# EAGLE schematic headstage-256 (EAGLE 8.3.2)
DESIGNER: JON NEWMAN; DESIGN_NAME: headstage-128-256; LICENSE: CERN OHL v1.2; REVISION: 1.1
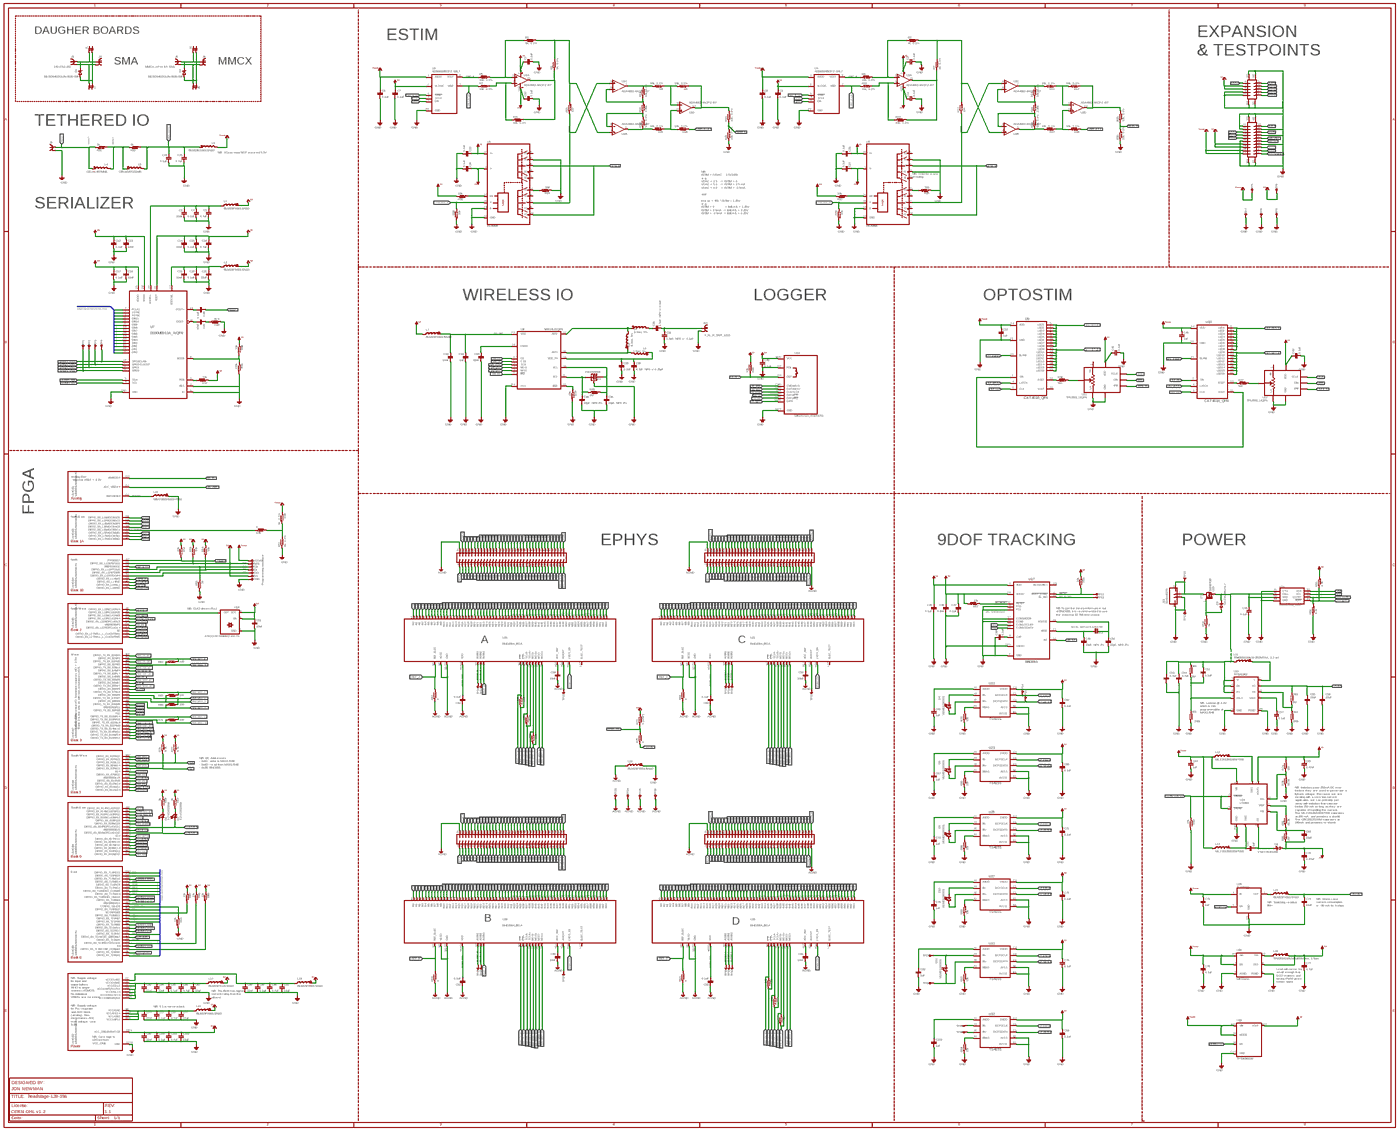
[diagram p0: schematic, sheet 1, overview]
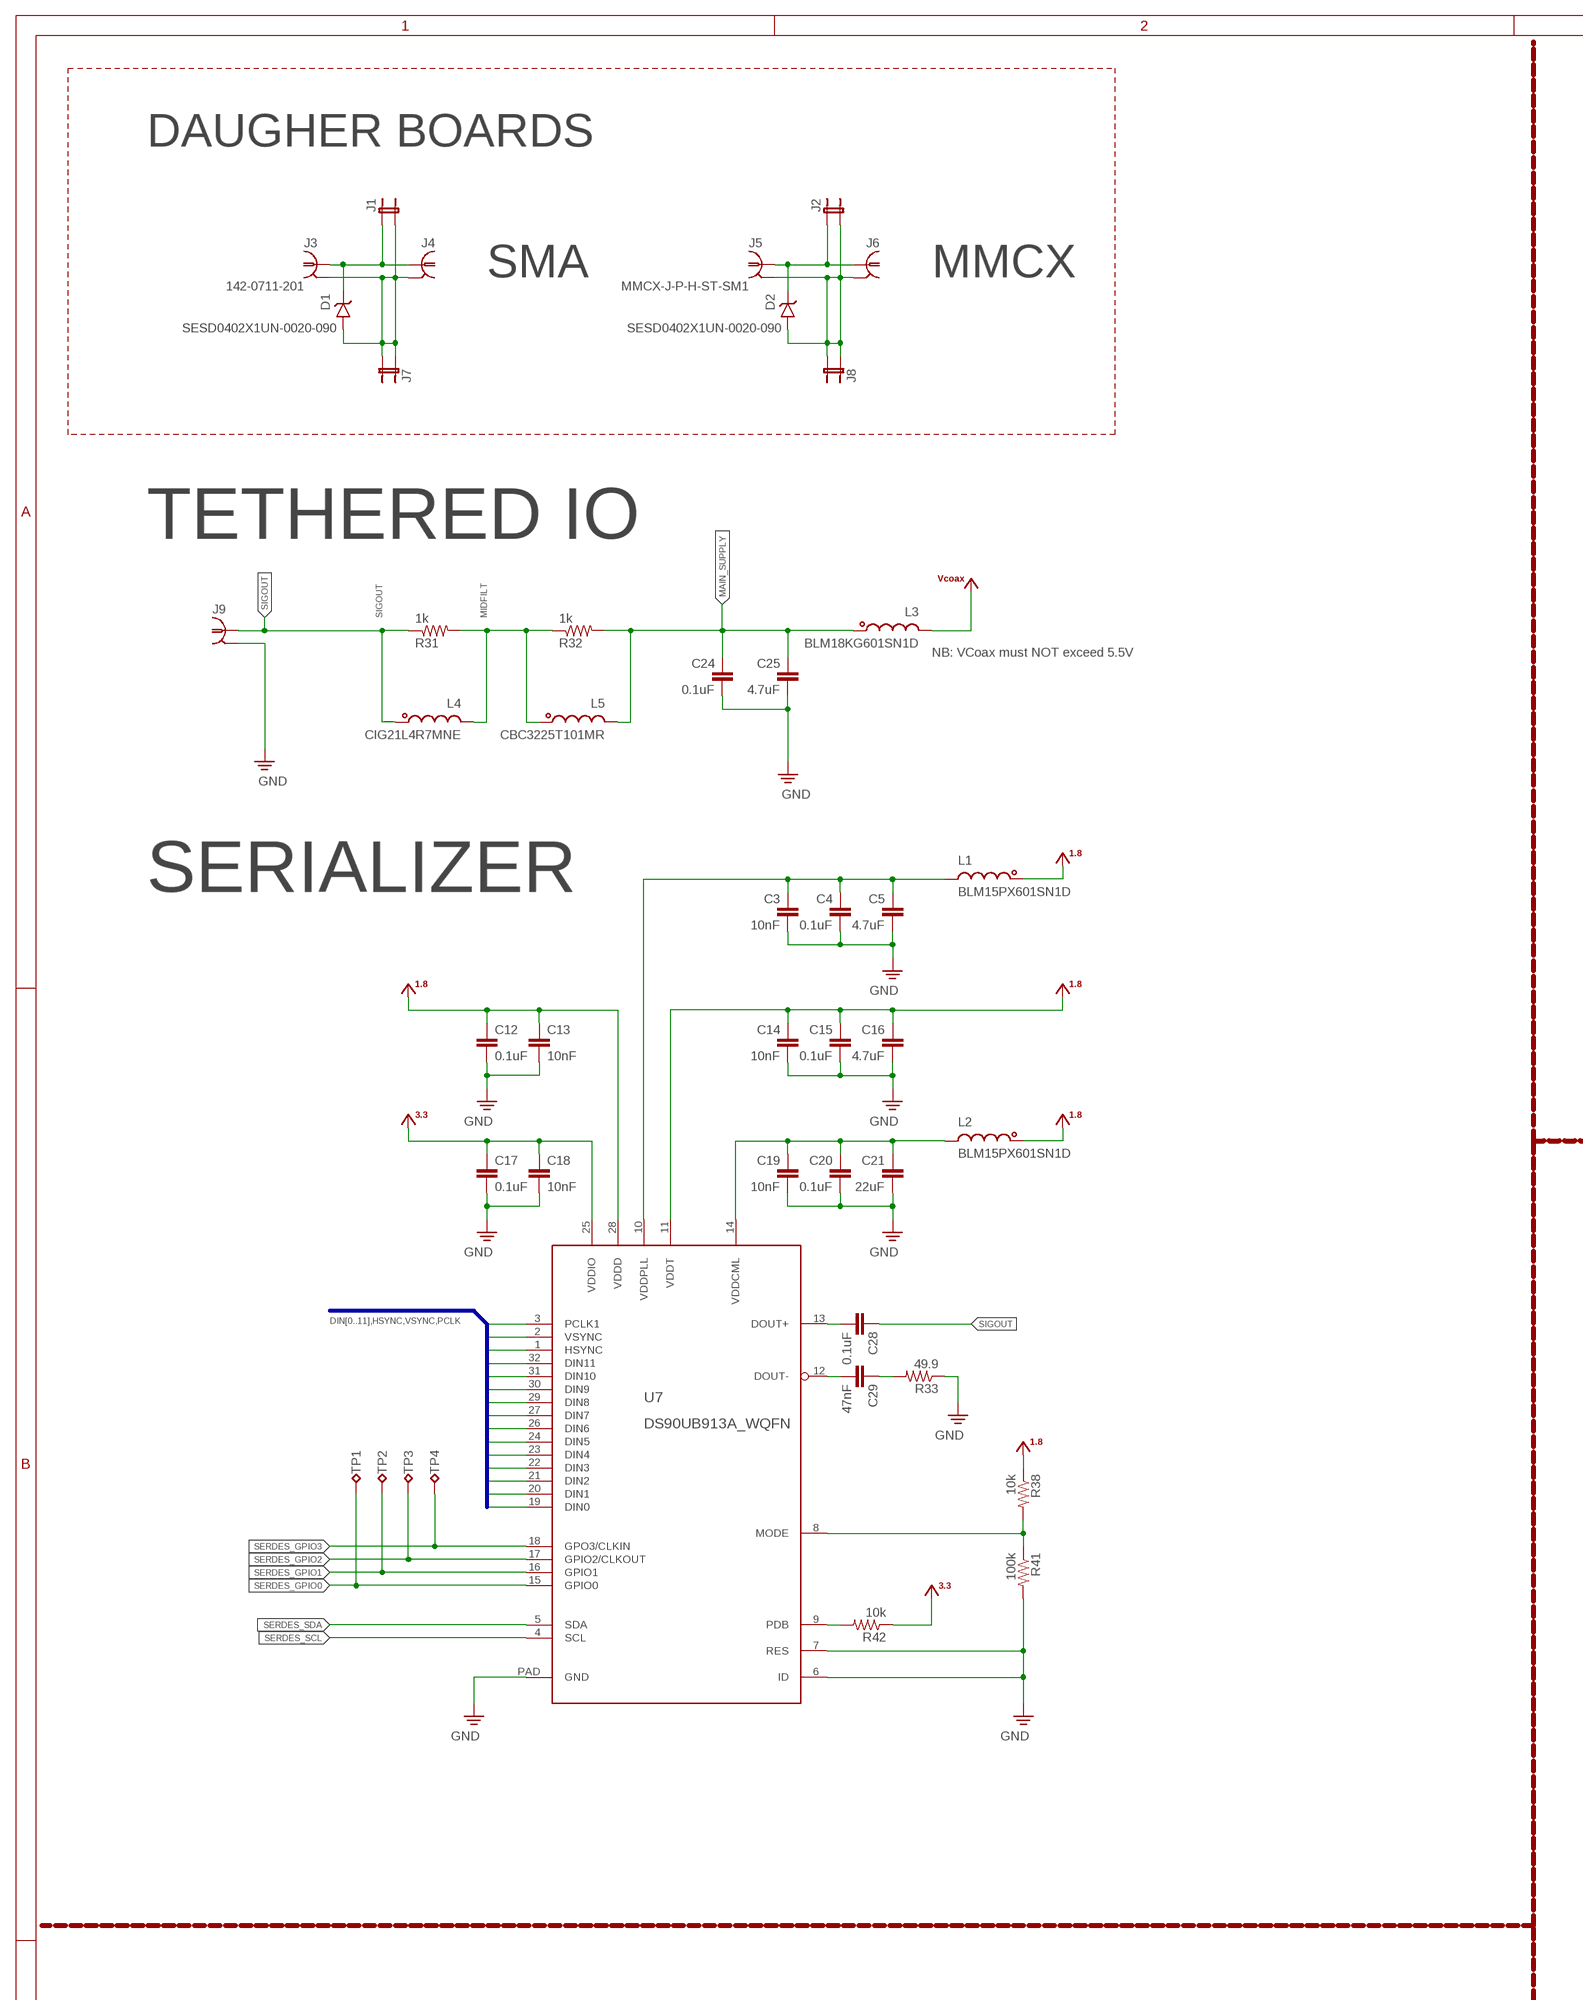
[diagram p1: schematic, sheet 1, part 1 of 9]
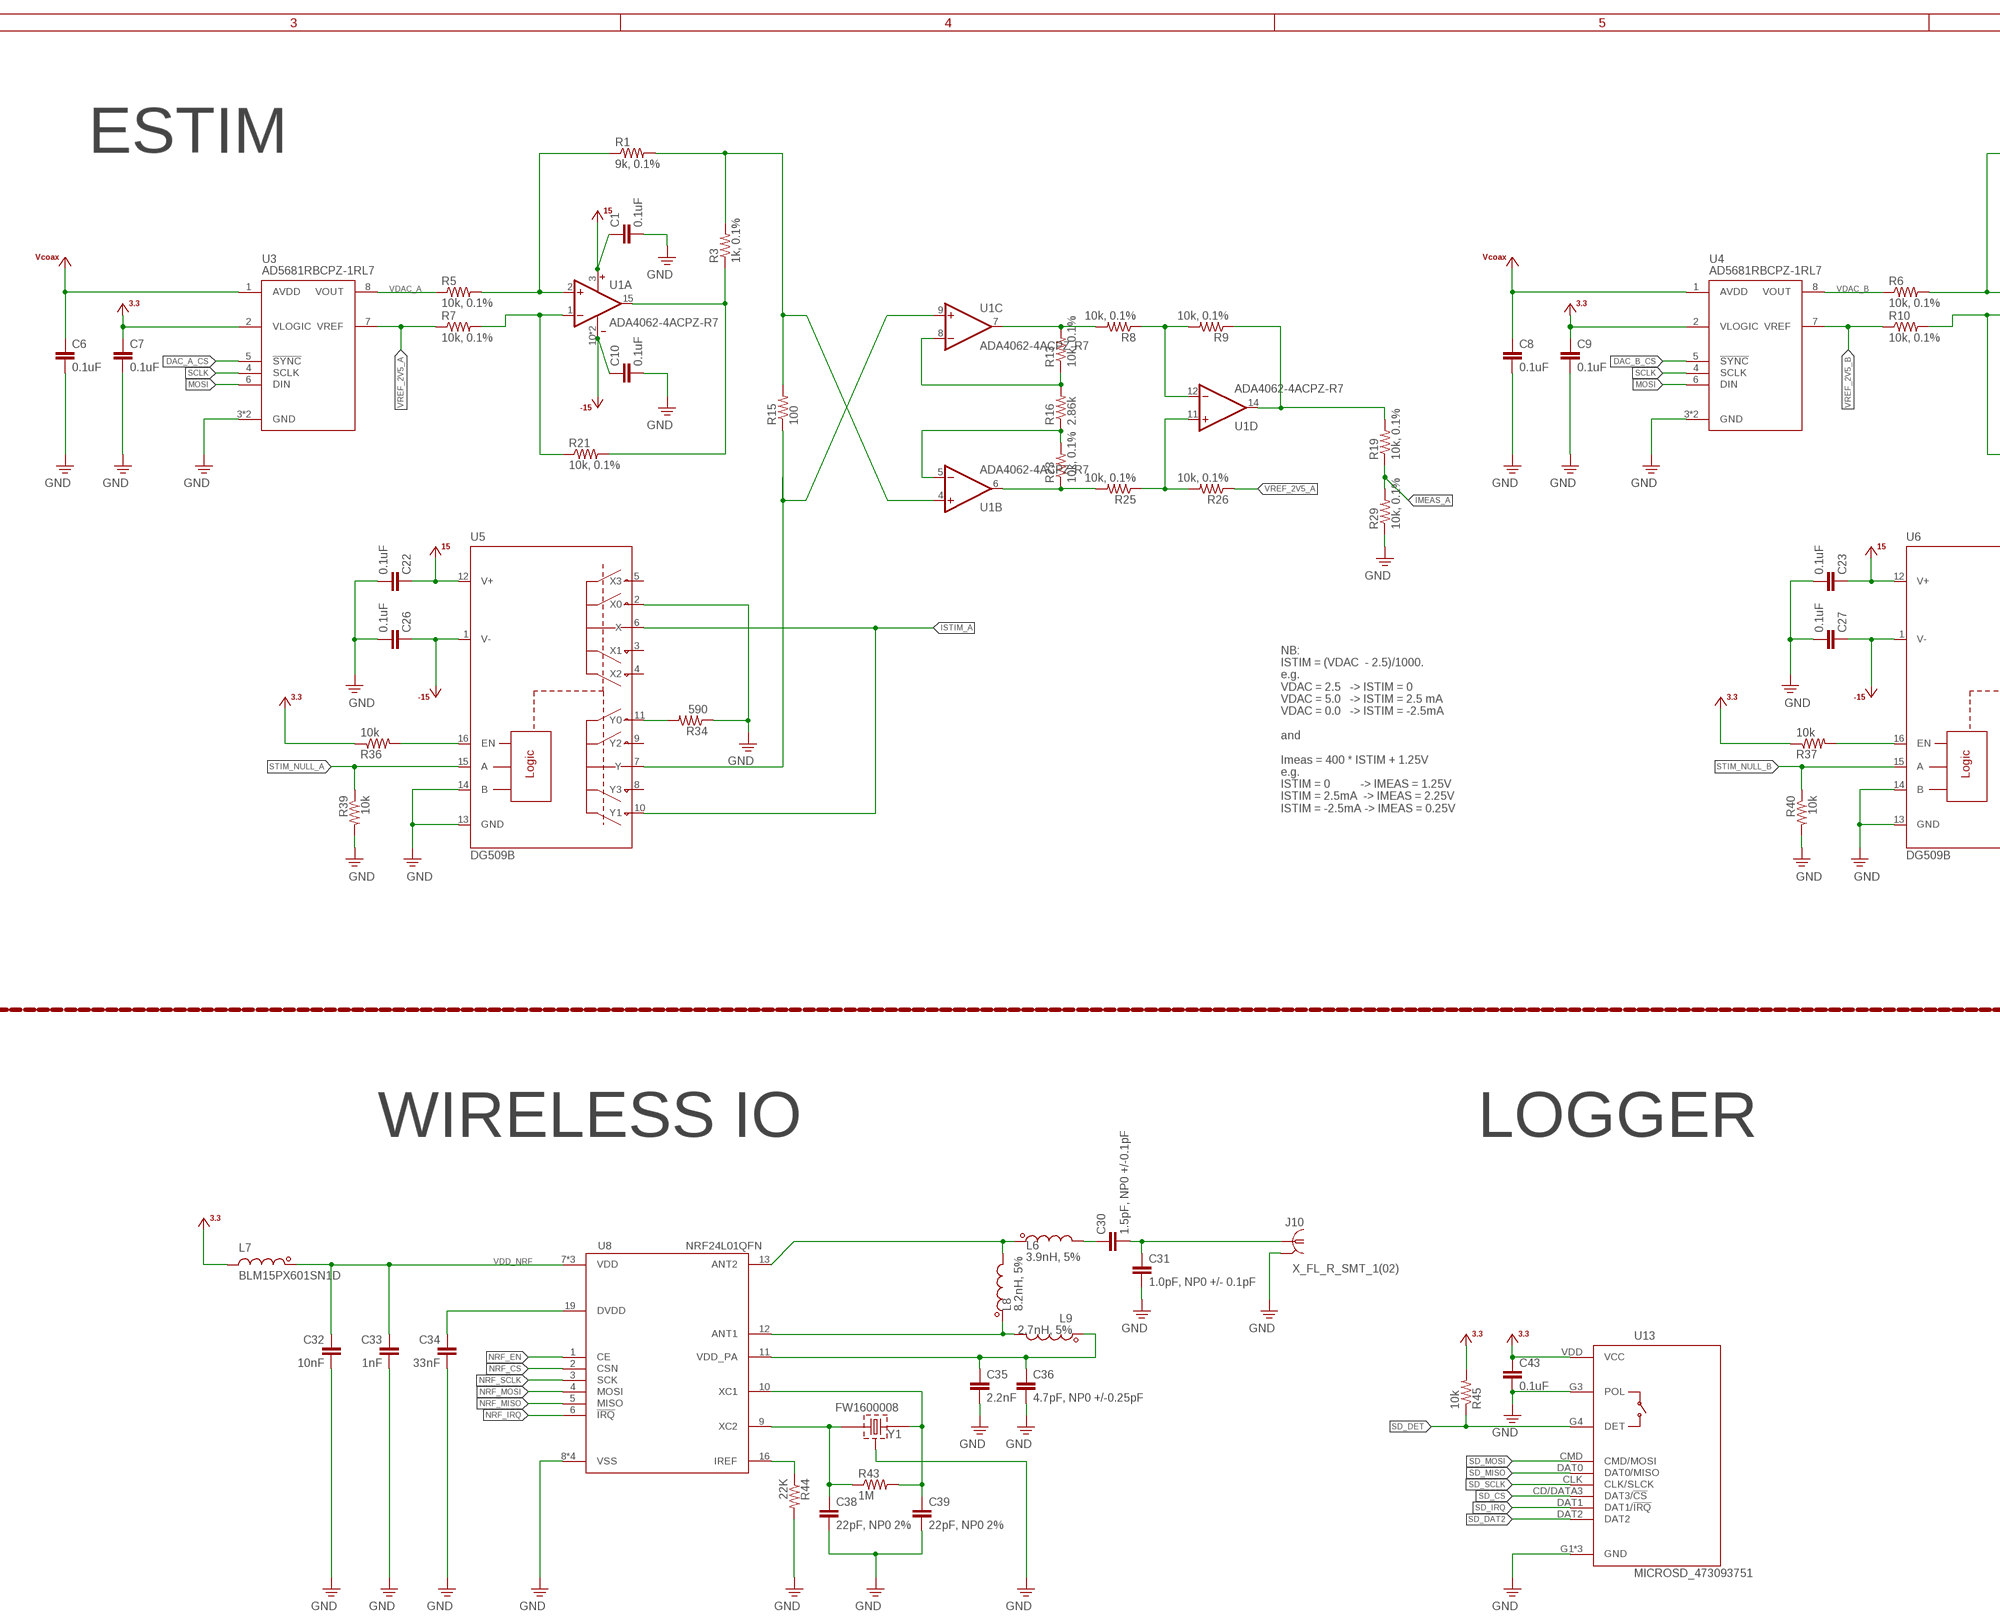
[diagram p2: schematic, sheet 1, part 2 of 9]
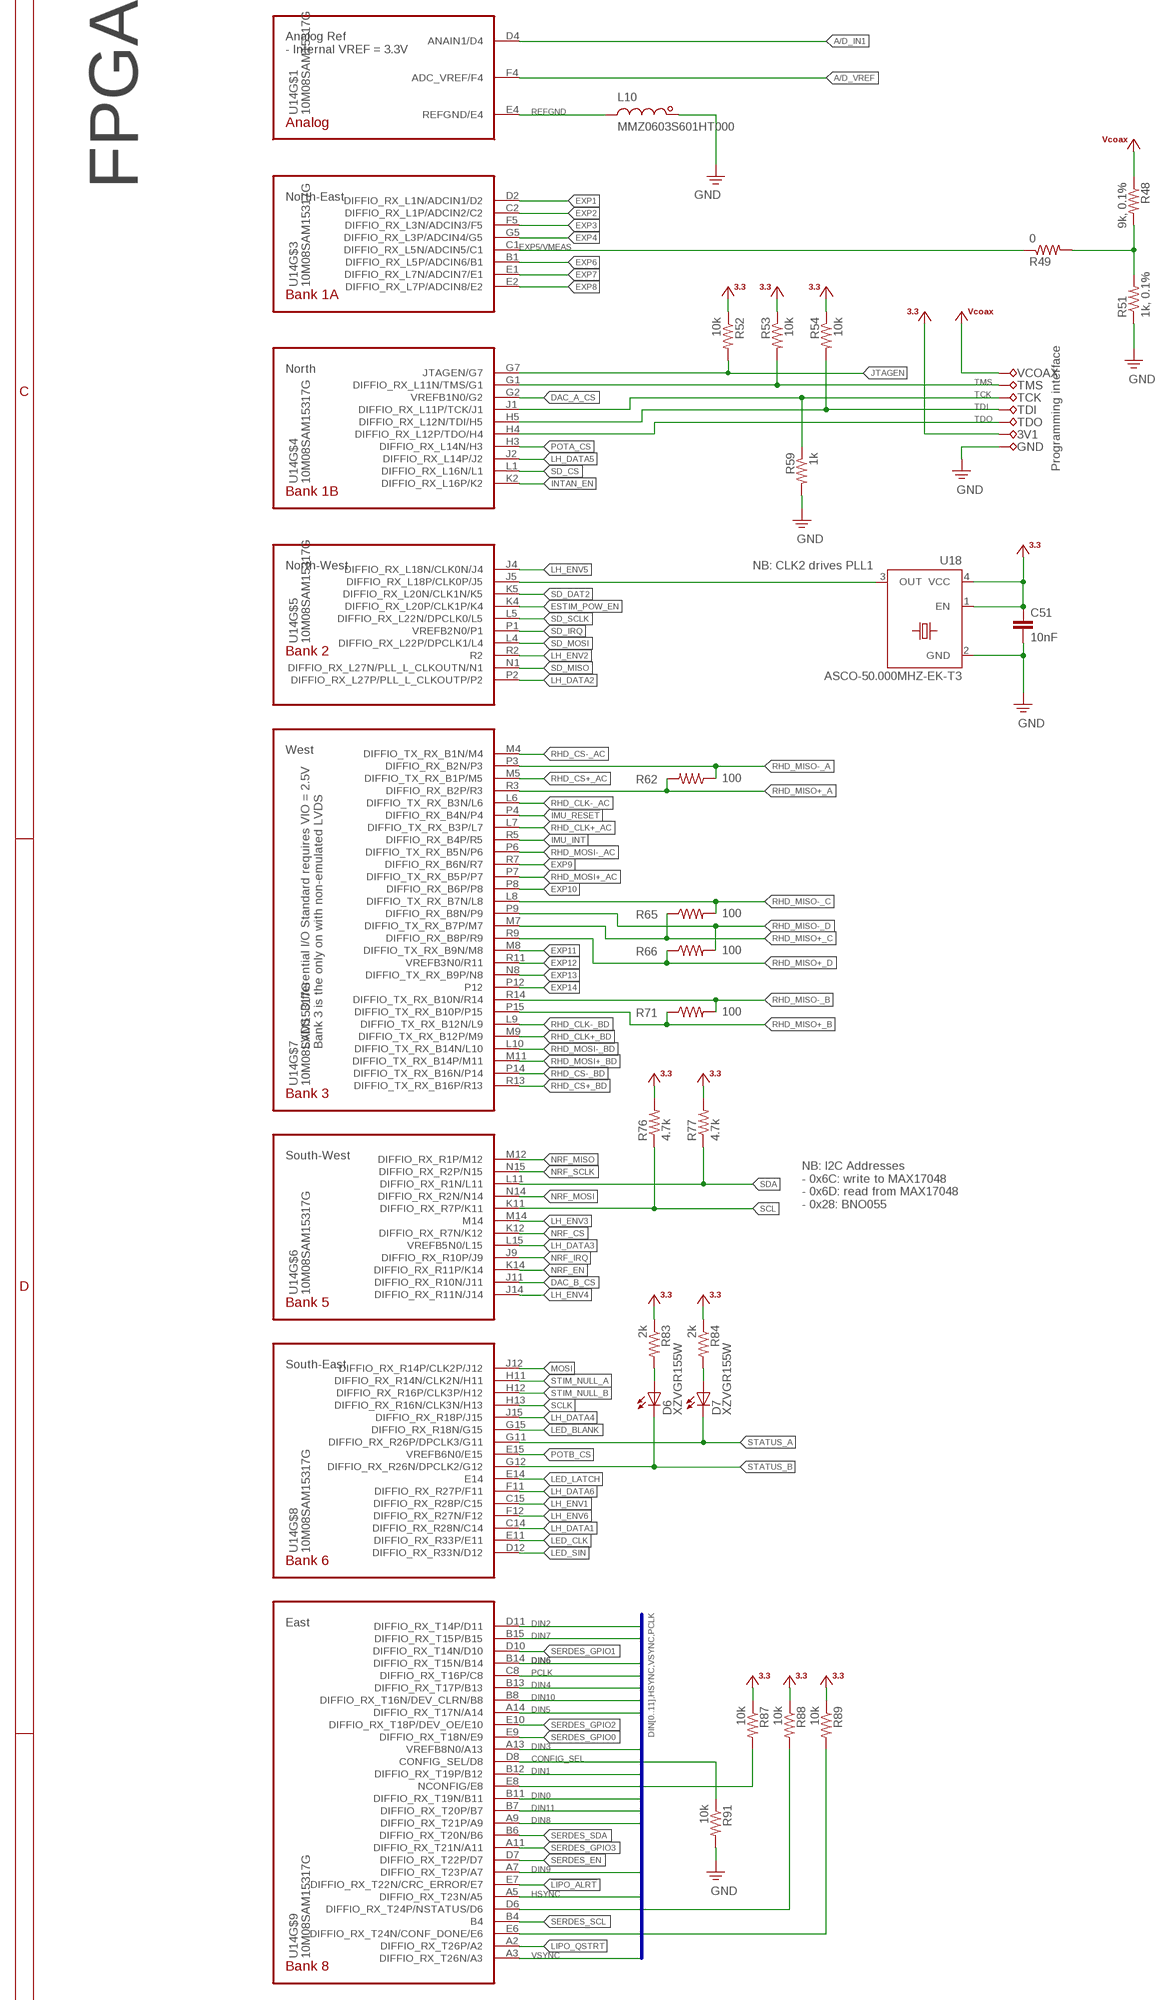
[diagram p3: schematic, sheet 1, part 3 of 9]
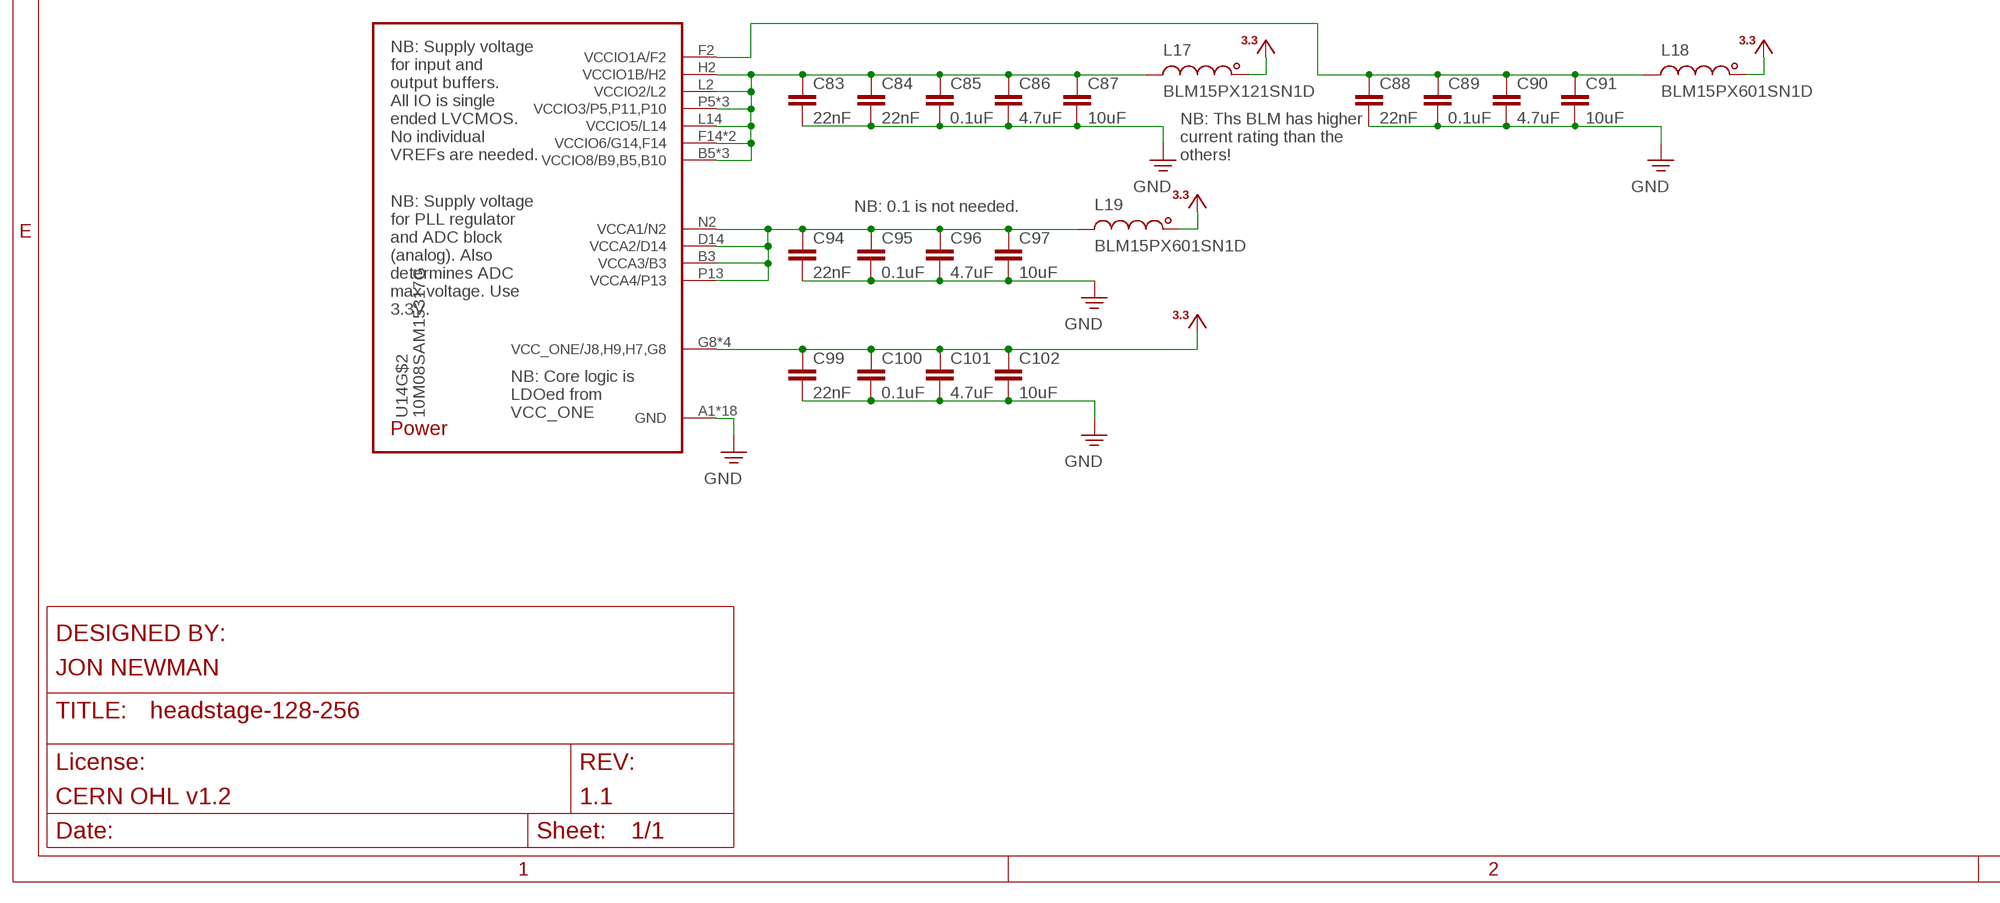
[diagram p4: schematic, sheet 1, part 4 of 9]
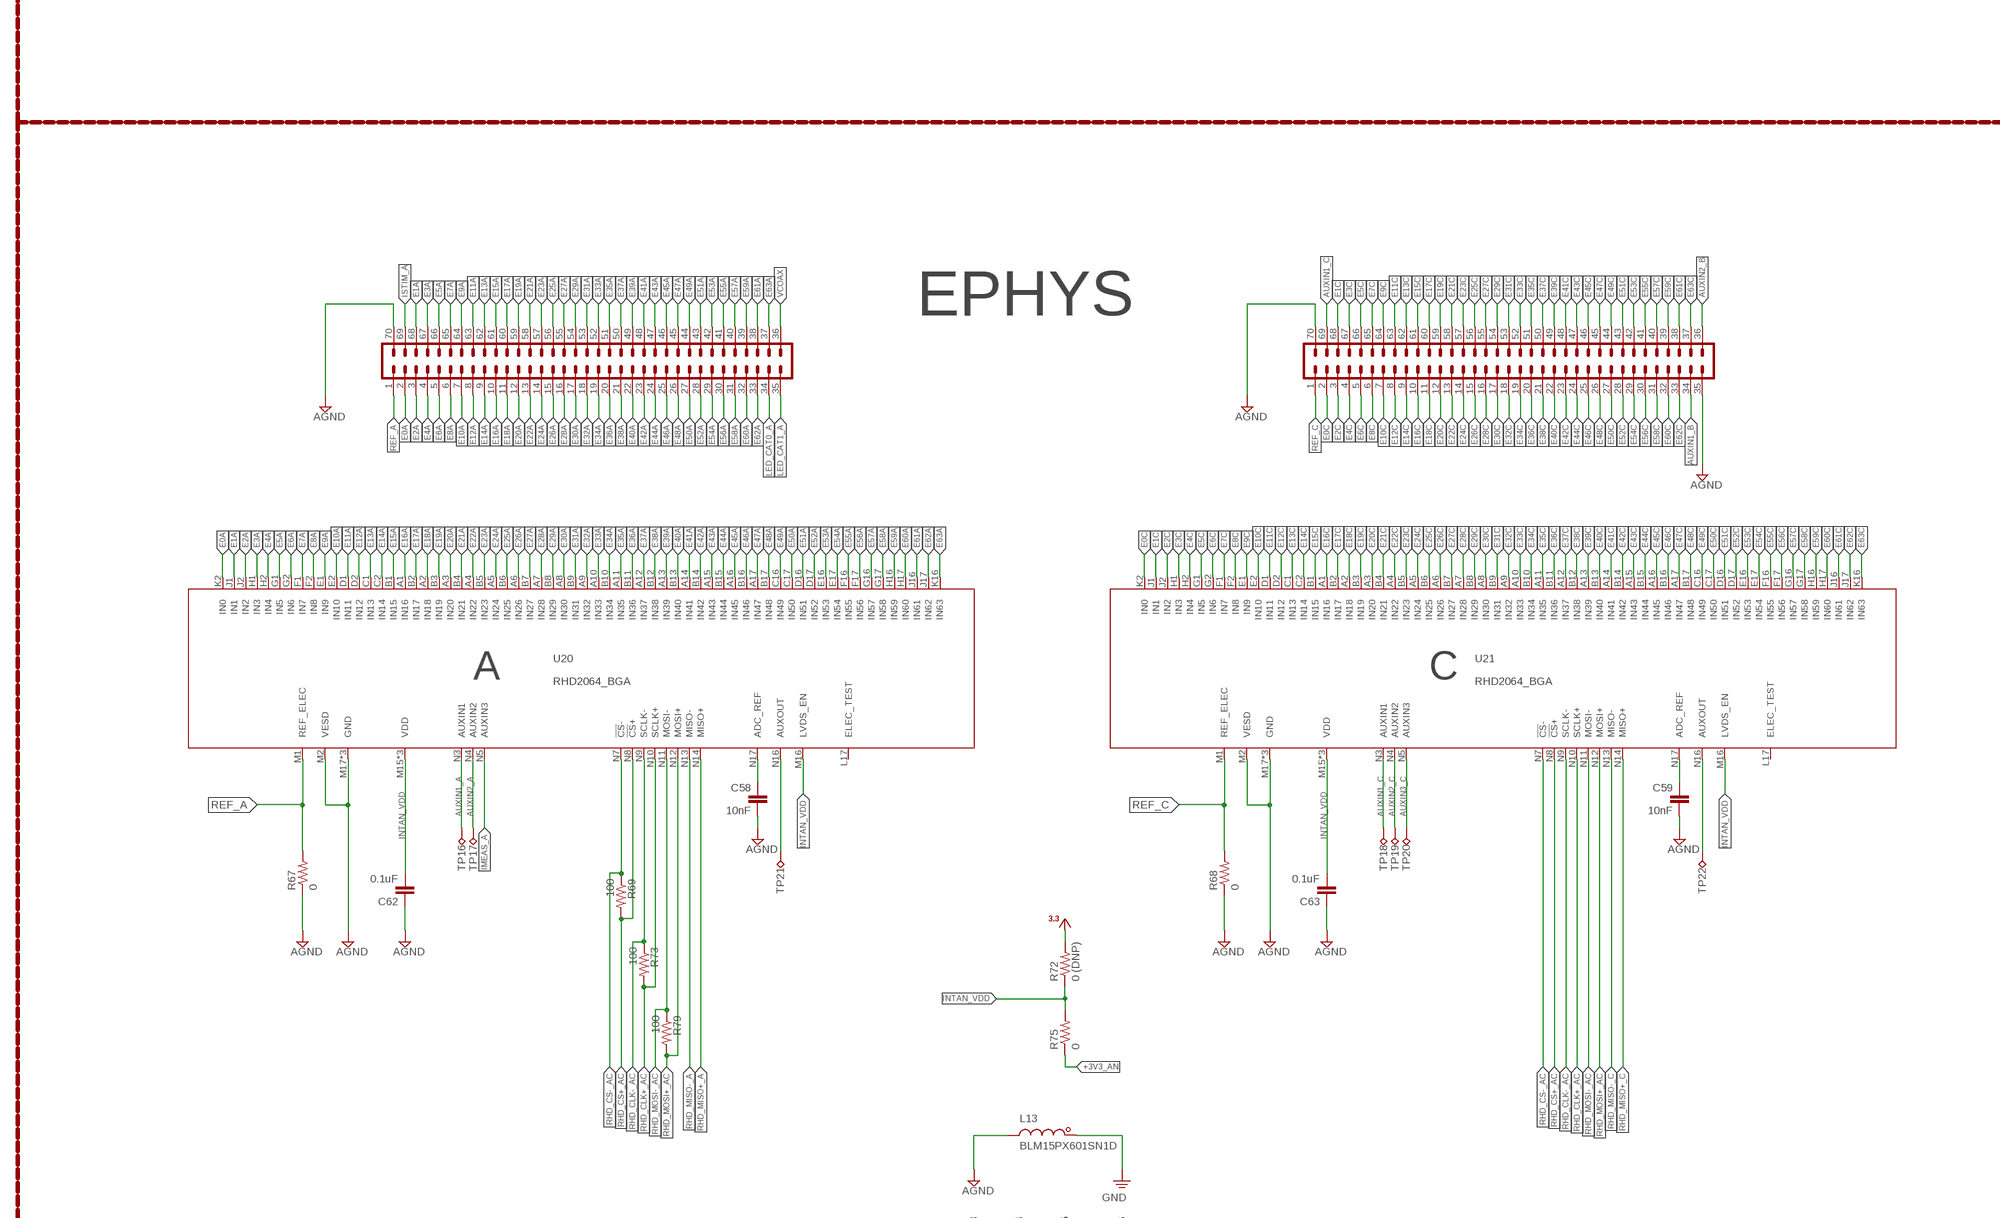
[diagram p5: schematic, sheet 1, part 5 of 9]
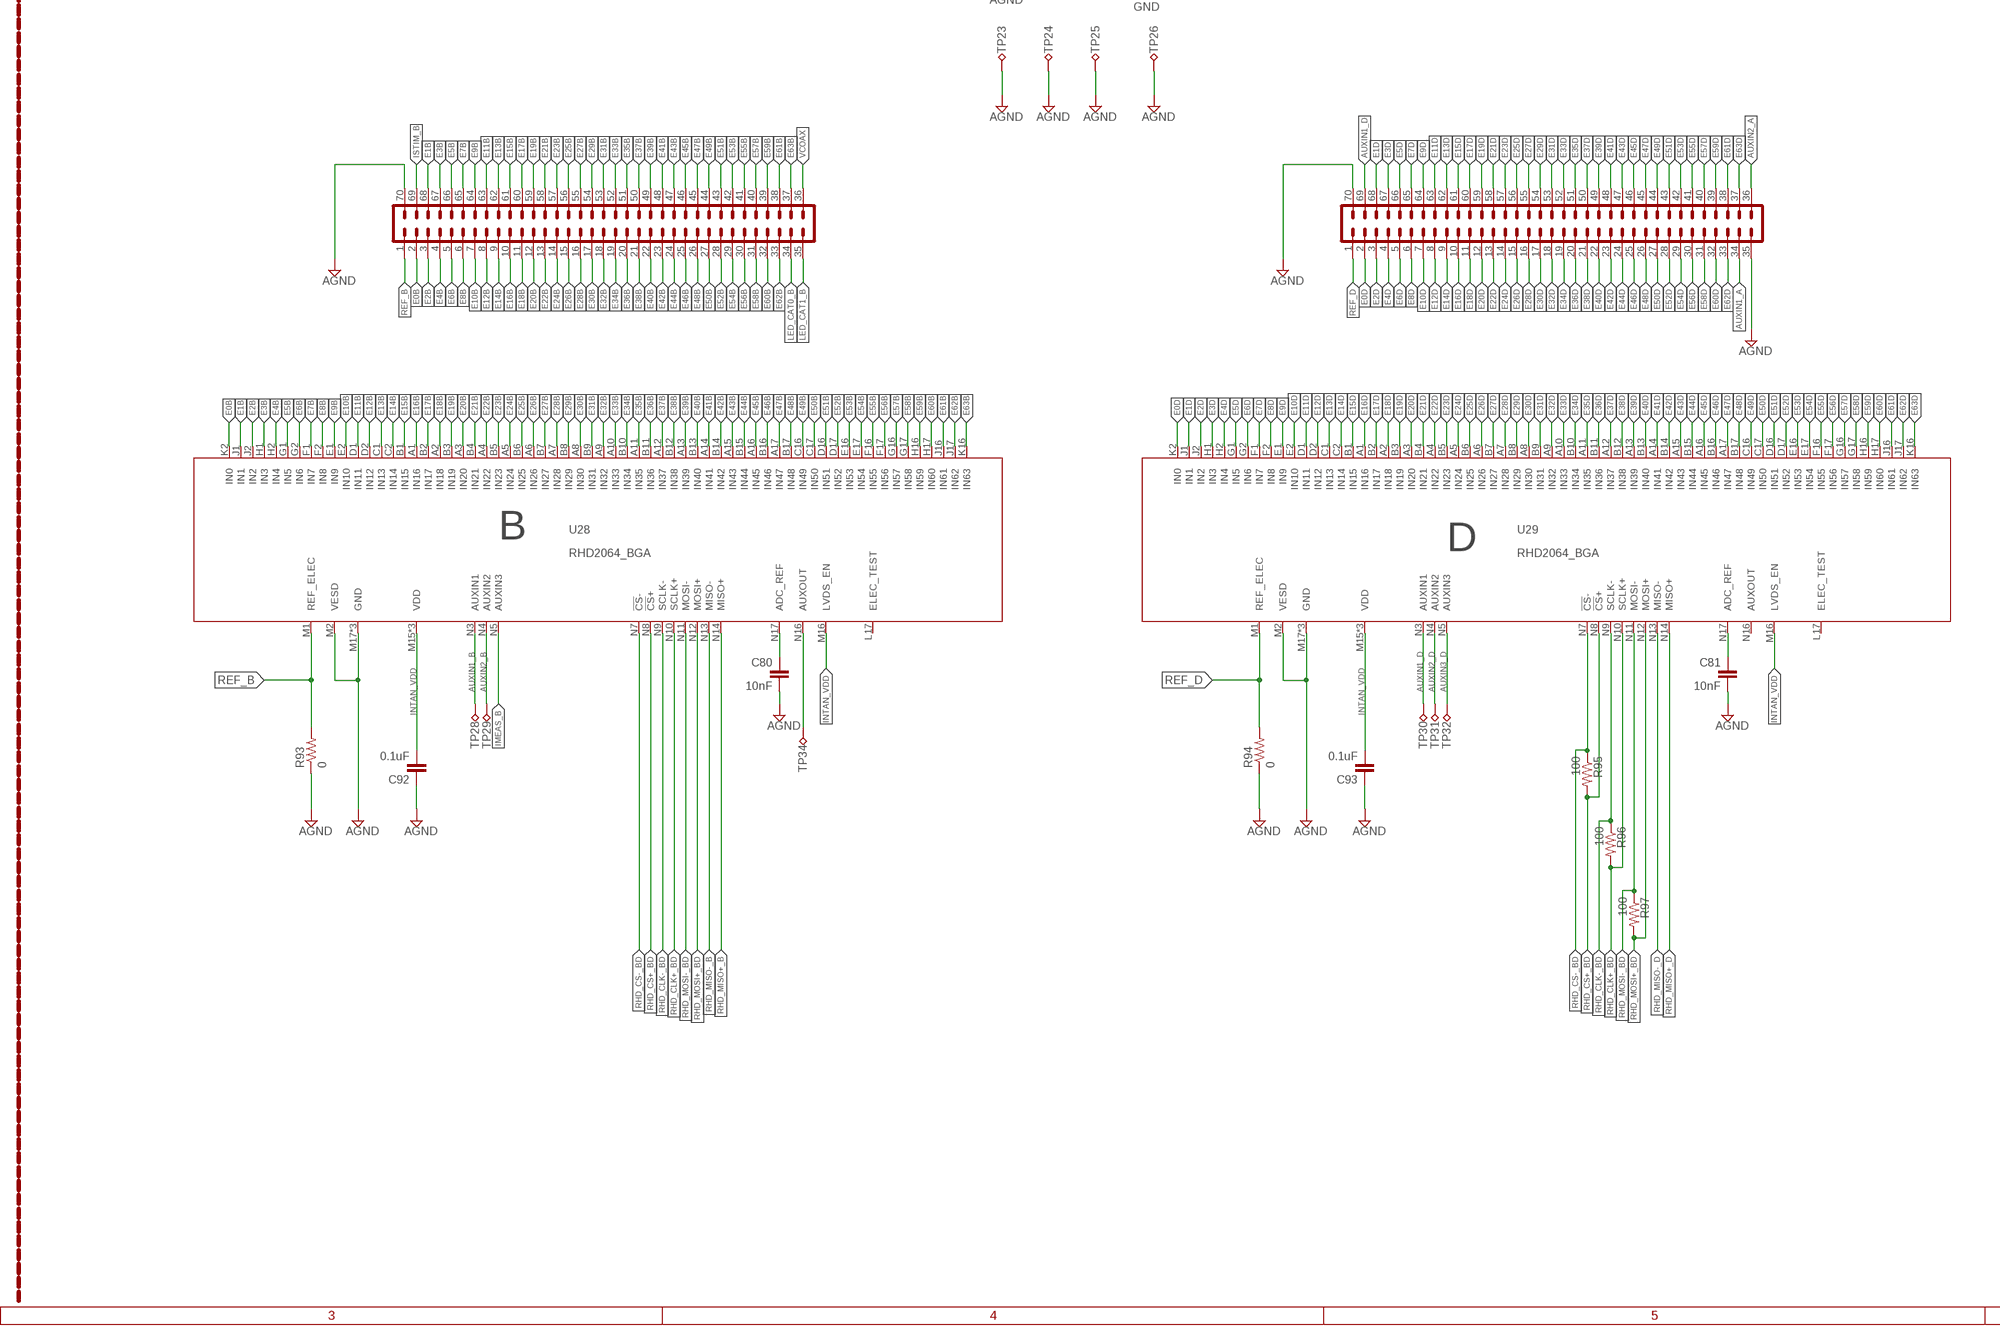
[diagram p6: schematic, sheet 1, part 6 of 9]
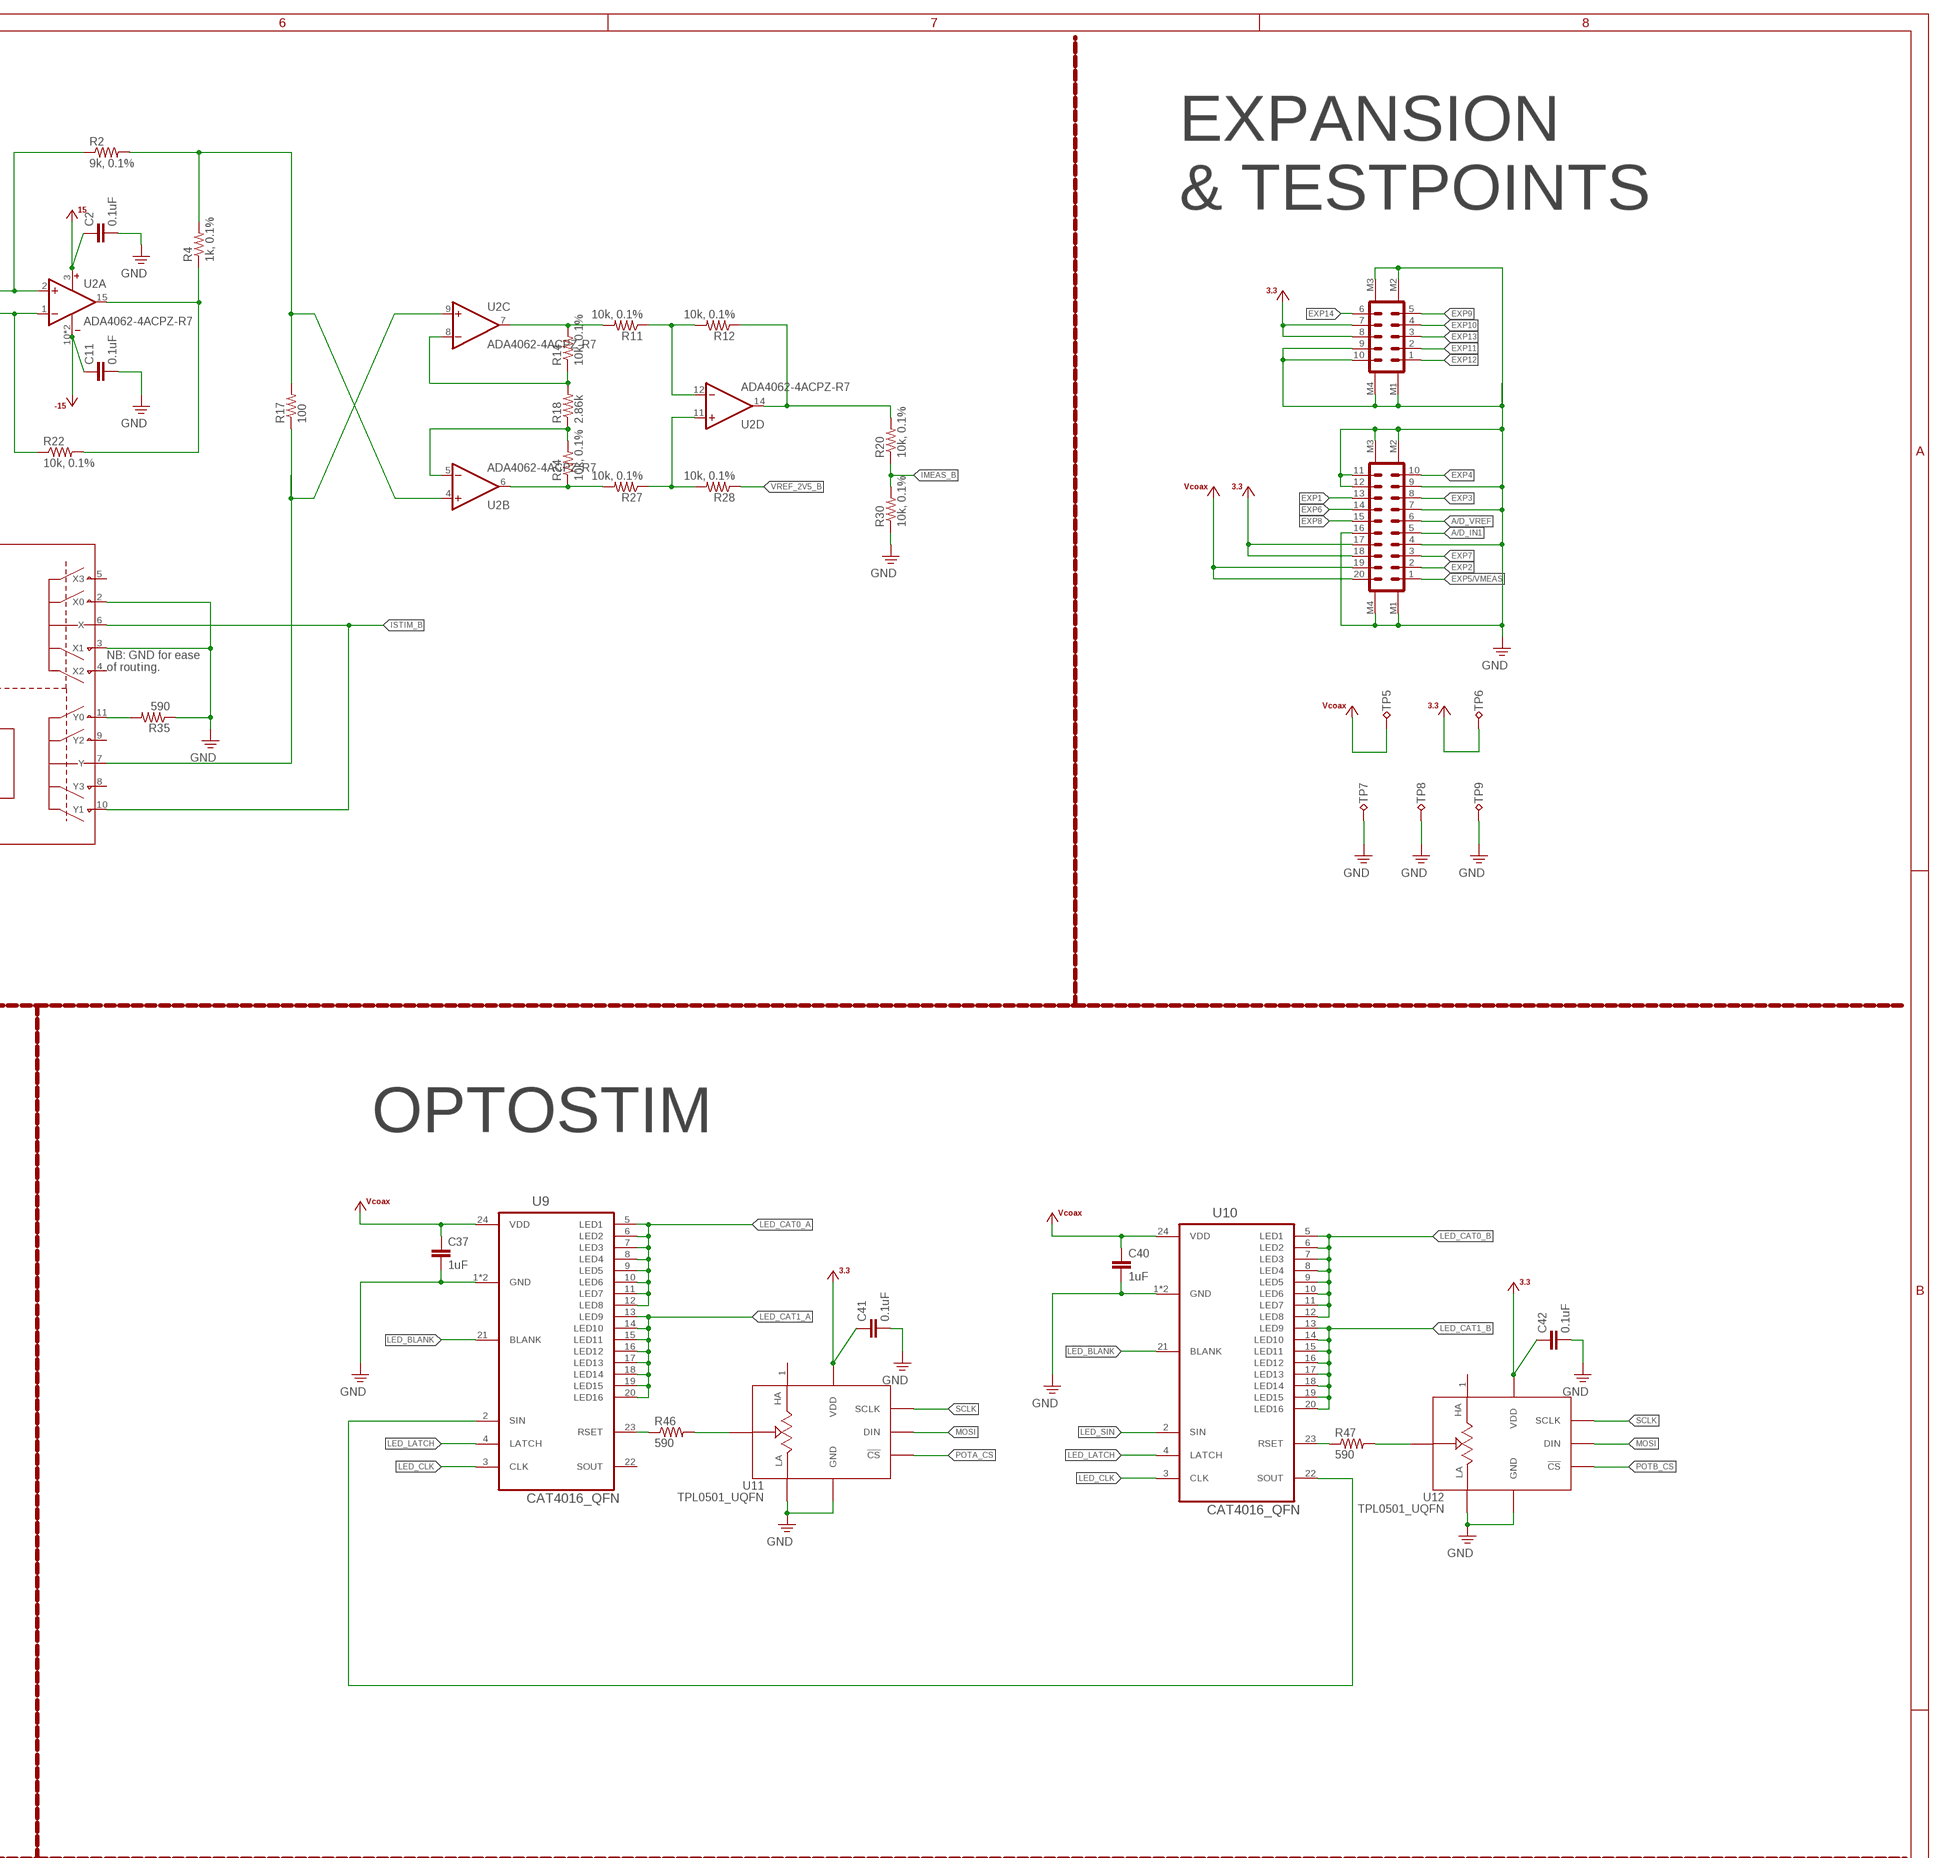
[diagram p7: schematic, sheet 1, part 7 of 9]
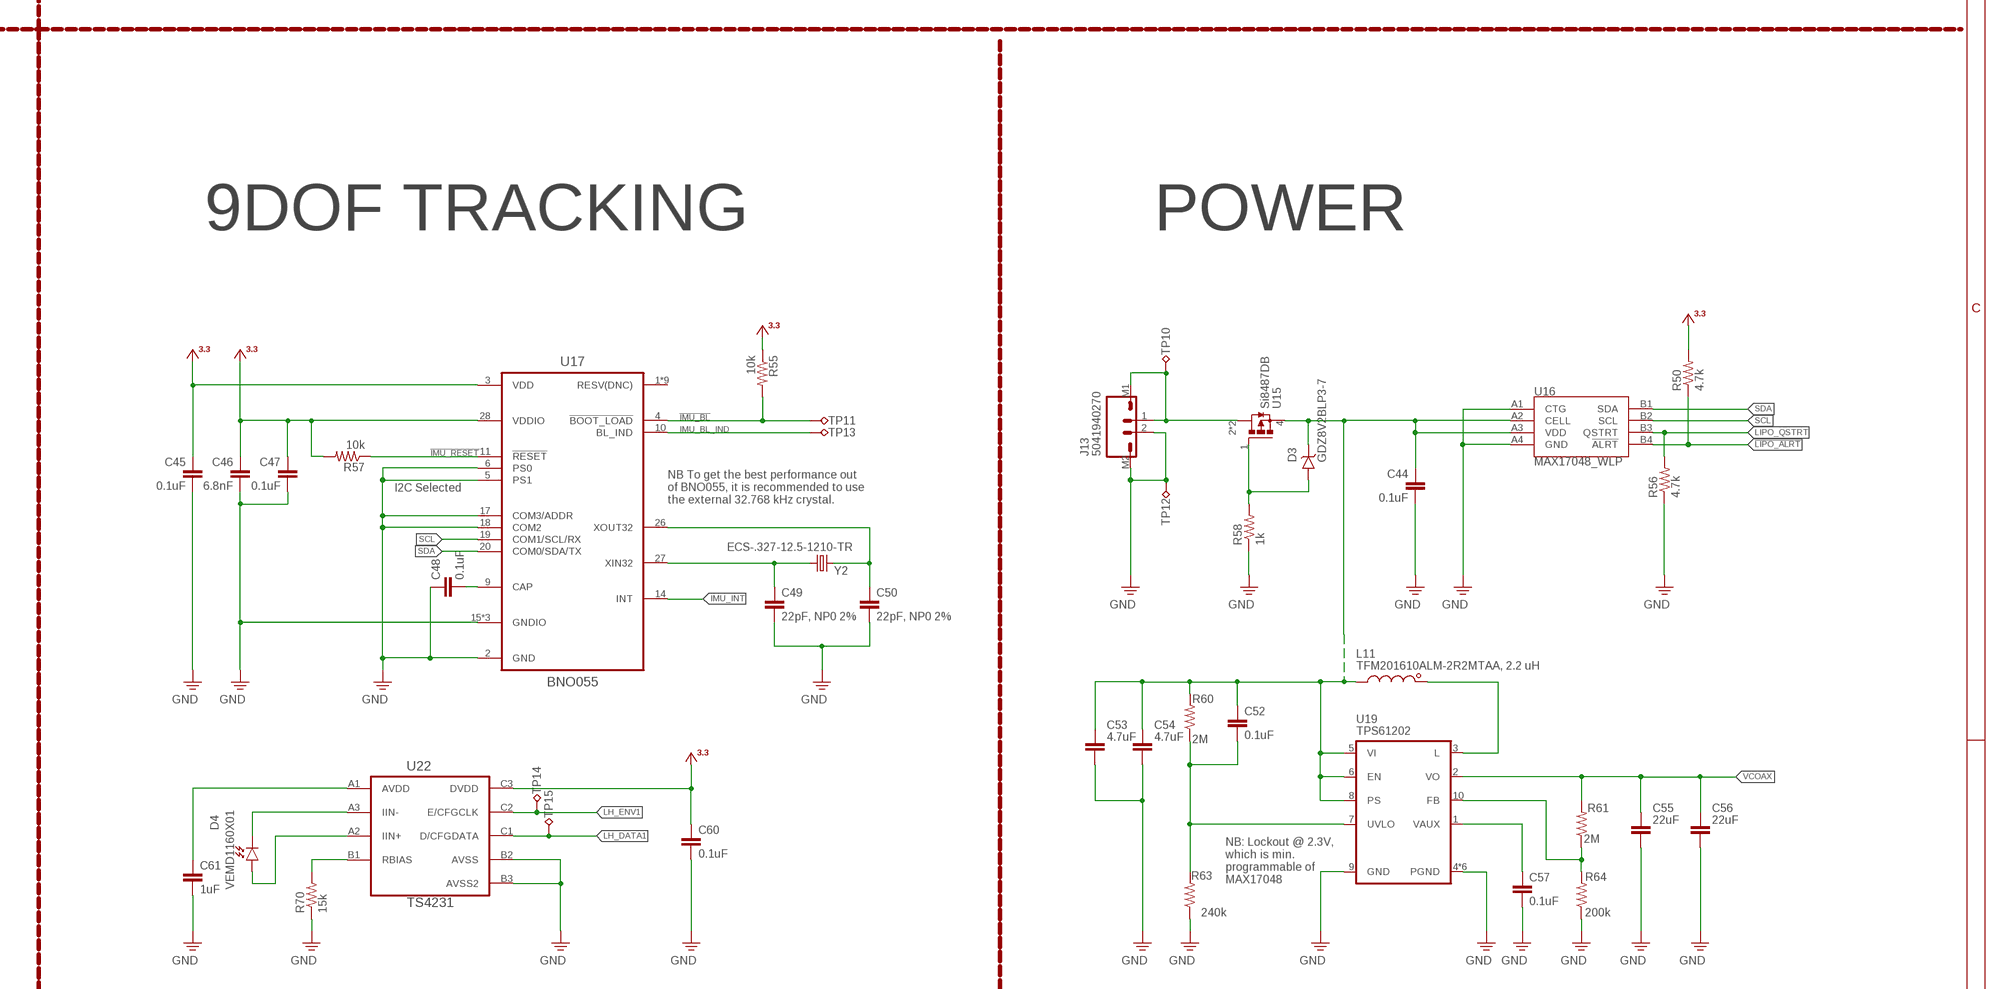
[diagram p8: schematic, sheet 1, part 8 of 9]
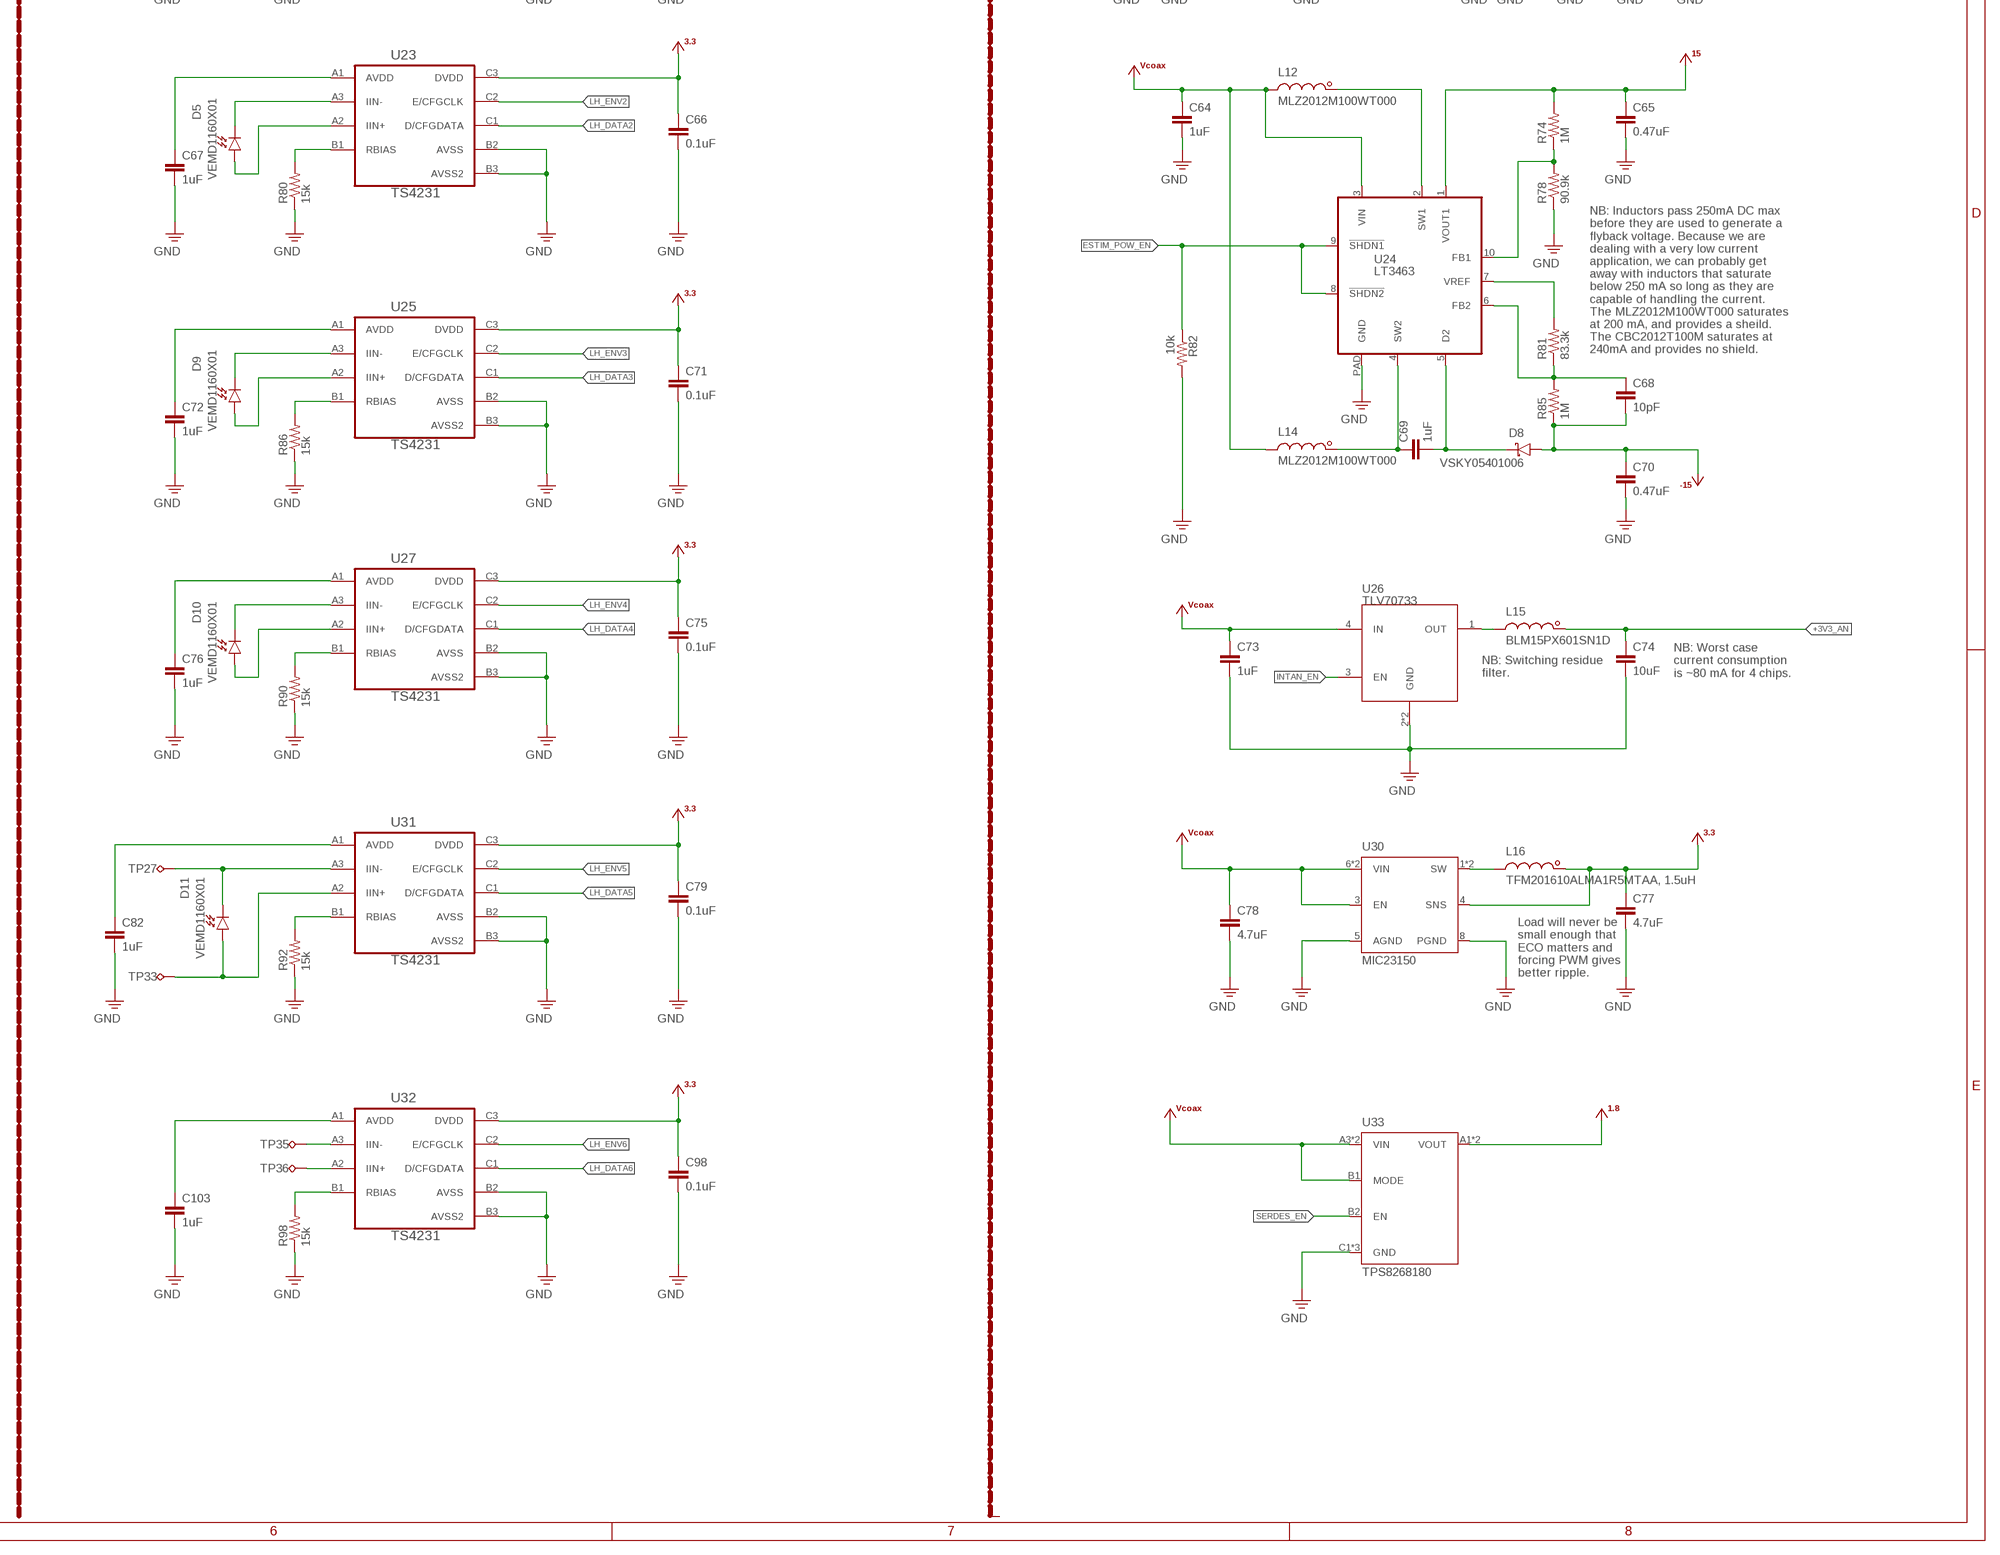
[diagram p9: schematic, sheet 1, part 9 of 9]

## Parts
3V1  TPTP10R  [TP10R]
C1  0.1uF  C_0201T  [0201T]
C2  0.1uF  C_0201T  [0201T]
C3  10nF  C_0201T  [0201T]
C4  0.1uF  C_0201T  [0201T]
C5  4.7uF  C_0402T  [0402T]
C6  0.1uF  C_0201T  [0201T]
C7  0.1uF  C_0201T  [0201T]
C8  0.1uF  C_0201T  [0201T]
C9  0.1uF  C_0201T  [0201T]
C10  0.1uF  C_0201T  [0201T]
C11  0.1uF  C_0201T  [0201T]
C12  0.1uF  C_0201T  [0201T]
C13  10nF  C_0201T  [0201T]
C14  10nF  C_0201T  [0201T]
C15  0.1uF  C_0201T  [0201T]
C16  4.7uF  C_0402T  [0402T]
C17  0.1uF  C_0201T  [0201T]
C18  10nF  C_0201T  [0201T]
C19  10nF  C_0201T  [0201T]
C20  0.1uF  C_0201T  [0201T]
C21  22uF  C_0603T  [0603T]
C22  0.1uF  C_0201T  [0201T]
C23  0.1uF  C_0201T  [0201T]
C24  0.1uF  C_0201T  [0201T]
C25  4.7uF  C_0402T  [0402T]
C26  0.1uF  C_0201T  [0201T]
C27  0.1uF  C_0201T  [0201T]
C28  0.1uF  C_0201T  [0201T]
C29  47nF  C_0201T  [0201T]
C30  1.5pF, NP0 +/-0.1pF  C_0402T  [0402T]
C31  1.0pF, NP0 +/- 0.1pF  C_0402T  [0402T]
C32  10nF  C_0201T  [0201T]
C33  1nF  C_0201T  [0201T]
C34  33nF  C_0201T  [0201T]
C35  2.2nF  C_0402T  [0402T]
C36  4.7pF, NP0 +/-0.25pF  C_0402T  [0402T]
C37  1uF  C_0402T  [0402T]
C38  22pF, NP0 2%  C_0402T  [0402T]
C39  22pF, NP0 2%  C_0402T  [0402T]
C40  1uF  C_0402T  [0402T]
C41  0.1uF  C_0201T  [0201T]
C42  0.1uF  C_0201T  [0201T]
C43  0.1uF  C_0201T  [0201T]
C44  0.1uF  C_0201T  [0201T]
C45  0.1uF  C_0201T  [0201T]
C46  6.8nF  C_0201T  [0201T]
C47  0.1uF  C_0201T  [0201T]
C48  0.1uF  C_0201T  [0201T]
C49  22pF, NP0 2%  C_0402T  [0402T]
C50  22pF, NP0 2%  C_0402T  [0402T]
C51  10nF  C_0201T  [0201T]
C52  0.1uF  C_0201T  [0201T]
C53  4.7uF  C_0402T  [0402T]
C54  4.7uF  C_0402T  [0402T]
C55  22uF  C_0603T  [0603T]
C56  22uF  C_0603T  [0603T]
C57  0.1uF  C_0201T  [0201T]
C58  10nF  C_0201T  [0201T]
C59  10nF  C_0201T  [0201T]
C60  0.1uF  C_0201T  [0201T]
C61  1uF  C_0201T  [0201T]
C62  0.1uF  C_0201T  [0201T]
C63  0.1uF  C_0201T  [0201T]
C64  1uF  C_0402T  [0402T]
C65  0.47uF  C_0402T  [0402T]
C66  0.1uF  C_0201T  [0201T]
C67  1uF  C_0201T  [0201T]
C68  10pF  C_0201T  [0201T]
C69  1uF  C_0402T  [0402T]
C70  0.47uF  C_0402T  [0402T]
C71  0.1uF  C_0201T  [0201T]
C72  1uF  C_0201T  [0201T]
C73  1uF  C_0402T  [0402T]
C74  10uF  C_0402T  [0402T]
C75  0.1uF  C_0201T  [0201T]
C76  1uF  C_0201T  [0201T]
C77  4.7uF  C_0402T  [0402T]
C78  4.7uF  C_0402T  [0402T]
C79  0.1uF  C_0201T  [0201T]
C80  10nF  C_0201T  [0201T]
C81  10nF  C_0201T  [0201T]
C82  1uF  C_0201T  [0201T]
C83  22nF  C_0201T  [0201T]
C84  22nF  C_0201T  [0201T]
C85  0.1uF  C_0201T  [0201T]
C86  4.7uF  C_0402T  [0402T]
C87  10uF  C_0402T  [0402T]
C88  22nF  C_0201T  [0201T]
C89  0.1uF  C_0201T  [0201T]
C90  4.7uF  C_0402T  [0402T]
C91  10uF  C_0402T  [0402T]
C92  0.1uF  C_0201T  [0201T]
C93  0.1uF  C_0201T  [0201T]
C94  22nF  C_0201T  [0201T]
C95  0.1uF  C_0201T  [0201T]
C96  4.7uF  C_0402T  [0402T]
C97  10uF  C_0402T  [0402T]
C98  0.1uF  C_0201T  [0201T]
C99  22nF  C_0201T  [0201T]
C100  0.1uF  C_0201T  [0201T]
C101  4.7uF  C_0402T  [0402T]
C102  10uF  C_0402T  [0402T]
C103  1uF  C_0201T  [0201T]
D1  SESD0402X1UN-0020-090  Z-DIODE_0402T-DFN  [0402T-DFN]
D2  SESD0402X1UN-0020-090  Z-DIODE_0402P-DFN  [0402P-DFN]
D3  GDZ8V2BLP3-7  Z-DIODE_GDZ  [GDZ8V2BLP3]
D4  VEMD1160X01  PHOTODIODE_0805PT  [0805PT]
D5  VEMD1160X01  PHOTODIODE_0805PT  [0805PT]
D6  XZVGR155W  LED_0201T  [LED-0201T]
D7  XZVGR155W  LED_0201T  [LED-0201T]
D8  VSKY05401006  S-DIODE_CLP1006-2L  [CLP1006-2L]
D9  VEMD1160X01  PHOTODIODE_0805PT  [0805PT]
D10  VEMD1160X01  PHOTODIODE_0805PT  [0805PT]
D11  VEMD1160X01  PHOTODIODE_0805PT  [0805PT]
GND  TPTP10R  [TP10R]
J1  JP2E_COAX-ADAPTER-8X8MM-SIG-THRU  [COAX-ADAPTER-8X8MM-SIG-THRU]
J2  JP2E_COAX-ADAPTER-8X8MM-SIG-THRU  [COAX-ADAPTER-8X8MM-SIG-THRU]
J3  142-0711-201  COAX_SMA-VERT-SMA  [SMA_VERT]
J4  COAX_COAX-ADAPTER-8X8MM-THRU  [COAX-ADAPTER-8X8MM-THRU]
J5  MMCX-J-P-H-ST-SM1  COAX_MMCX-VERT  [MMCX-SMT-VERT]
J6  COAX_COAX-ADAPTER-8X8MM-THRU  [COAX-ADAPTER-8X8MM-THRU]
J7  JP2E_COAX-ADAPTER-8X8MM-GND-THRU  [COAX-ADAPTER-8X8MM-GND-THRU]
J8  JP2E_COAX-ADAPTER-8X8MM-GND-THRU  [COAX-ADAPTER-8X8MM-GND-THRU]
J9  COAX_COAX-ADAPTER-8X8MM-SMD  [COAX-ADAPTER-8X8MM]
J10  X_FL_R_SMT_1(02)  COAX_XFL  [X_FL_R_SMT_1(02)]
J11  PINHD-2X10+4_DF40-HEAD  [DF40-20HEAD]
J12  PINHD-2X5+4DF40-HEAD  [DF40-10HEAD]
J13  5041940270  PINHD-1X2+2_MICROLOCK-VERT  [MICROLOCK-1X2-VERT]
JA  DF40C(2.0)-70DS-0.4V(51)  PINHD-2X35_DF40REC  [DF40-70REC]
JB  DF40C(2.0)-70DS-0.4V(51)  PINHD-2X35_DF40REC  [DF40-70REC]
JC  DF40C(2.0)-70DS-0.4V(51)  PINHD-2X35_DF40REC  [DF40-70REC]
JD  DF40C(2.0)-70DS-0.4V(51)  PINHD-2X35_DF40REC  [DF40-70REC]
L1  BLM15PX601SN1D  L_0402T  [0402T]
L2  BLM15PX601SN1D  L_0402T  [0402T]
L3  BLM18KG601SN1D  L_0603T  [0603T]
L4  CIG21L4R7MNE  L_0805T  [0805T]
L5  CBC3225T101MR  L_1210T  [1210T]
L6  3.9nH, 5%  L_0402T  [0402T]
L7  BLM15PX601SN1D  L_0402T  [0402T]
L8  8.2nH, 5%  L_0402T  [0402T]
L9  2.7nH, 5%  L_0402T  [0402T]
L10  MMZ0603S601HT000  L_0201T  [0201T]
L11  TFM201610ALM-2R2MTAA, 2.2 uH  L_0806T  [0806T]
L12  MLZ2012M100WT000  L_0805T  [0805T]
L13  BLM15PX601SN1D  L_0402T  [0402T]
L14  MLZ2012M100WT000  L_0805T  [0805T]
L15  BLM15PX601SN1D  L_0402T  [0402T]
L16  TFM201610ALMA1R5MTAA, 1.5uH  L_0806T  [0806T]
L17  BLM15PX121SN1D  L_0402T  [0402T]
L18  BLM15PX601SN1D  L_0402T  [0402T]
L19  BLM15PX601SN1D  L_0402T  [0402T]
R1  9k, 0.1%  R_0201T  [0201T]
R2  9k, 0.1%  R_0201T  [0201T]
R3  1k, 0.1%  R_0201T  [0201T]
R4  1k, 0.1%  R_0201T  [0201T]
R5  10k, 0.1%  R_0201T  [0201T]
R6  10k, 0.1%  R_0201T  [0201T]
R7  10k, 0.1%  R_0201T  [0201T]
R8  10k, 0.1%  R_0201T  [0201T]
R9  10k, 0.1%  R_0201T  [0201T]
R10  10k, 0.1%  R_0201T  [0201T]
R11  10k, 0.1%  R_0201T  [0201T]
R12  10k, 0.1%  R_0201T  [0201T]
R13  10k, 0.1%  R_0201T  [0201T]
R14  10k, 0.1%  R_0201T  [0201T]
R15  100  R_0201T  [0201T]
R16  2.86k  R_0201T  [0201T]
R17  100  R_0201T  [0201T]
R18  2.86k  R_0201T  [0201T]
R19  10k, 0.1%  R_0201T  [0201T]
R20  10k, 0.1%  R_0201T  [0201T]
R21  10k, 0.1%  R_0201T  [0201T]
R22  10k, 0.1%  R_0201T  [0201T]
R23  10k, 0.1%  R_0201T  [0201T]
R24  10k, 0.1%  R_0201T  [0201T]
R25  10k, 0.1%  R_0201T  [0201T]
R26  10k, 0.1%  R_0201T  [0201T]
R27  10k, 0.1%  R_0201T  [0201T]
R28  10k, 0.1%  R_0201T  [0201T]
R29  10k, 0.1%  R_0201T  [0201T]
R30  10k, 0.1%  R_0201T  [0201T]
R31  1k  R_0201T  [0201T]
R32  1k  R_0201T  [0201T]
R33  49.9  R_0201T  [0201T]
R34  590  R_0201T  [0201T]
R35  590  R_0201T  [0201T]
R36  10k  R_0201T  [0201T]
R37  10k  R_0201T  [0201T]
R38  10k  R_0201T  [0201T]
R39  10k  R_0201T  [0201T]
R40  10k  R_0201T  [0201T]
R41  100k  R_0201T  [0201T]
R42  10k  R_0201T  [0201T]
R43  1M  R_0201T  [0201T]
R44  22K  R_0201T  [0201T]
R45  10k  R_0201T  [0201T]
R46  590  R_0201T  [0201T]
R47  590  R_0201T  [0201T]
R48  9k, 0.1%  R_0201T  [0201T]
R49  0  R_0201T  [0201T]
R50  4.7k  R_0201T  [0201T]
R51  1k, 0.1%  R_0201T  [0201T]
R52  10k  R_0201T  [0201T]
R53  10k  R_0201T  [0201T]
R54  10k  R_0201T  [0201T]
R55  10k  R_0201T  [0201T]
R56  4.7k  R_0201T  [0201T]
R57  10k  R_0201T  [0201T]
R58  1k  R_0201T  [0201T]
R59  1k  R_0201T  [0201T]
R60  2M  R_0201T  [0201T]
R61  2M  R_0201T  [0201T]
R62  100  R_0201T  [0201T]
R63  240k  R_0201T  [0201T]
R64  200k  R_0201T  [0201T]
R65  100  R_0201T  [0201T]
R66  100  R_0201T  [0201T]
R67  0  R_0402  [0402]
R68  0  R_0402  [0402]
R69  100  R_0201T  [0201T]
R70  15k  R_0201T  [0201T]
R71  100  R_0201T  [0201T]
R72  0 (DNP)  R_0201T  [0201T]
R73  100  R_0201T  [0201T]
R74  1M  R_0201T  [0201T]
R75  0  R_0201T  [0201T]
R76  4.7k  R_0201T  [0201T]
R77  4.7k  R_0201T  [0201T]
R78  90.9k  R_0201T  [0201T]
R79  100  R_0201T  [0201T]
R80  15k  R_0201T  [0201T]
R81  83.3k  R_0201T  [0201T]
R82  10k  R_0201T  [0201T]
R83  2k  R_0201T  [0201T]
R84  2k  R_0201T  [0201T]
R85  1M  R_0201T  [0201T]
R86  15k  R_0201T  [0201T]
R87  10k  R_0201T  [0201T]
R88  10k  R_0201T  [0201T]
R89  10k  R_0201T  [0201T]
R90  15k  R_0201T  [0201T]
R91  10k  R_0201T  [0201T]
R92  15k  R_0201T  [0201T]
R93  0  R_0402  [0402]
R94  0  R_0402  [0402]
R95  100  R_0201T  [0201T]
R96  100  R_0201T  [0201T]
R97  100  R_0201T  [0201T]
R98  15k  R_0201T  [0201T]
TCK  TPTP10R  [TP10R]
TDI  TPTP10R  [TP10R]
TDO  TPTP10R  [TP10R]
TMS  TPTP10R  [TP10R]
TP1  TP_0.7MM  [TESTPOINT_0.7MM]
TP2  TP_0.7MM  [TESTPOINT_0.7MM]
TP3  TP_0.7MM  [TESTPOINT_0.7MM]
TP4  TP_0.7MM  [TESTPOINT_0.7MM]
TP5  TP_0.7MM  [TESTPOINT_0.7MM]
TP6  TP_0.7MM  [TESTPOINT_0.7MM]
TP7  TP_0.7MM  [TESTPOINT_0.7MM]
TP8  TP_0.7MM  [TESTPOINT_0.7MM]
TP9  TP_0.7MM  [TESTPOINT_0.7MM]
TP10  TP_0.7MM  [TESTPOINT_0.7MM]
TP11  TPTP07R  [TP07R]
TP12  TP_0.7MM  [TESTPOINT_0.7MM]
TP13  TPTP07R  [TP07R]
TP14  TPTP07R  [TP07R]
TP15  TPTP07R  [TP07R]
TP16  TPTP13R  [TP13R]
TP17  TPTP13R  [TP13R]
TP18  TPTP13R  [TP13R]
TP19  TPTP13R  [TP13R]
TP20  TPTP13R  [TP13R]
TP21  TPTP13R  [TP13R]
TP22  TPTP13R  [TP13R]
TP23  TPTP13R  [TP13R]
TP24  TPTP13R  [TP13R]
TP25  TPTP13R  [TP13R]
TP26  TPTP13R  [TP13R]
TP27  TP_0.7MM  [TESTPOINT_0.7MM]
TP28  TPTP13R  [TP13R]
TP29  TPTP13R  [TP13R]
TP30  TPTP13R  [TP13R]
TP31  TPTP13R  [TP13R]
TP32  TPTP13R  [TP13R]
TP33  TP_0.7MM  [TESTPOINT_0.7MM]
TP34  TPTP13R  [TP13R]
TP35  TP_0.7MM  [TESTPOINT_0.7MM]
TP36  TP_0.7MM  [TESTPOINT_0.7MM]
U1  ADA4062-4ACPZ-R7  QUAD-OPAMP_14PIN_CP_16_27_L  [CP_16_27-L]
U2  ADA4062-4ACPZ-R7  QUAD-OPAMP_14PIN_CP_16_27_L  [CP_16_27-L]
U3  AD5681RBCPZ-1RL7  AD5683-VLOGIC_CP_8_10-L  [CP_8_10-L]
U4  AD5681RBCPZ-1RL7  AD5683-VLOGIC_CP_8_10-L  [CP_8_10-L]
U5  DG509B  MUX_2X4:1_DG509B-MQFN  [MQFN16-1.8X2.6]
U6  DG509B  MUX_2X4:1_DG509B-MQFN  [MQFN16-1.8X2.6]
U7  DS90UB913A_WQFN  [WQFN32-5X5]
U8  NRF24L01QFN  [QFN20-4X4MM_NO-PAD]
U9  CAT4016_QFN  [QFN24-4X4]
U10  CAT4016_QFN  [QFN24-4X4]
U11  TPL0501_UQFN  [UQFN]
U12  TPL0501_UQFN  [UQFN]
U13  MICROSD_473093751  [MICRO-SD-473093751]
U14  10M08SAM15317G  10M08SAM153_MBGA  [MBGA153-8X8]
U15  Si8487DB  P-MOSFET_MICROFOOT-1.6X1.6MM  [MICROFOOT-1.6X1.6MM]
U16  MAX17048_WLP  MAX1704X_WLP  [WLP8-1.7X0.9]
U17  BNO055  [LGA-28-3.8X5.2]
U18  ASCO-50.000MHZ-EK-T3  CRYSTAL-OSC_ASCO  [ASCO]
U19  TPS61202  TPS61200  [PWSON-N10+4-3X3]
U20  RHD2064_BGA  RHD2164_BGA_BGA  [BGA104_0.5MM]
U21  RHD2064_BGA  RHD2164_BGA_BGA  [BGA104_0.5MM]
U22  TS4231  [WLCSP3X3]
U23  TS4231  [WLCSP3X3]
U24  LT3463  [DFN103X3]
U25  TS4231  [WLCSP3X3]
U26  TLV70733  TLV707  [X2SON]
U27  TS4231  [WLCSP3X3]
U28  RHD2064_BGA  RHD2164_BGA_BGA  [BGA104_0.5MM]
U29  RHD2064_BGA  RHD2164_BGA_BGA  [BGA104_0.5MM]
U30  MIC23150  [TDFN_2X2MM]
U31  TS4231  [WLCSP3X3]
U32  TS4231  [WLCSP3X3]
U33  TPS8268180  TPS8268X  [MICROSIP9-3X2.3]
VCOAX  TPTP10R  [TP10R]
Y1  FW1600008  CRYSTAL-GND_FW2X1.6MM  [FW2X1.6MM]
Y2  ECS-.327-12.5-1210-TR  CRYSTAL_ECX-1210  [ECX-1210]

## Nets
!IMU_BL: R55.2 TP11.TP U17.4(!BOOT_LOAD)
!IMU_RESET: R57.1 U14.P4(DIFFIO_RX_B4N/P4) U17.11(!RESET)
!LIPO_ALRT: R50.1 U14.E7(DIFFIO_RX_T22N/CRC_ERROR/E7) U16.B4(!ALRT)
+1V8: C12.1 C13.1 C14.1 C15.1 C16.1 L1.1 L2.1 R38.1 U7.11(VDDT) U7.28(VDDD) U33.A1(VOUT) U33.A2(VOUT)
+3V3: 3V1.TP C7.1 C9.1 C17.1 C18.1 C41.1 C42.1 C43.1 C45.1 C46.1 C47.1 C51.1 C60.1 C66.1 C71.1 C75.1 C77.1 C79.1 C98.1 C99.1 C100.1 C101.1 C102.1 J11.17 J11.18 J12.7 J12.8 L7.2 L16.1 L17.1 L18.1 L19.1 R36.1 R37.1 R42.1 R45.2 R50.2 R52.1 R53.1 R54.1 R55.1 R57.2 R72.2 R76.2 R77.2 R83.1 R84.1 R87.1 R88.1 R89.1 TP6.1(TP) U3.2(VLOGIC) U4.2(VLOGIC) U7.25(VDDIO) U11.7(VDD) U12.7(VDD) U13.VDD(VCC) U14.G8(VCC_ONE/J8,H9,H7,G8) U14.H7(VCC_ONE/J8,H9,H7,G8) U14.H9(VCC_ONE/J8,H9,H7,G8) U14.J8(VCC_ONE/J8,H9,H7,G8) U17.3(VDD) U17.28(VDDIO) U18.1(EN) U18.4(VCC) U22.C3(DVDD) U23.C3(DVDD) U25.C3(DVDD) U27.C3(DVDD) U30.4(SNS) U31.C3(DVDD) U32.C3(DVDD)
+3V3_AN: C74.1 L15.1 R75.1
+15V0: C1.1 C2.1 C22.1 C23.1 C65.1 R74.2 U1.3(P:V+) U2.3(P:V+) U5.12(V+) U6.12(V+) U24.1(VOUT1) ; supply symbol labelled +15V
-15V0: C10.1 C11.1 C26.1 C27.1 C68.2 C70.1 D8.A R85.1 U1.10(P:V-) U1.PAD(P:V-) U2.10(P:V-) U2.PAD(P:V-) U5.1(V-) U6.1(V-) ; supply symbol labelled -15V
A/D_IN1: J11.5 U14.D4(ANAIN1/D4)
A/D_VREF: J11.6 U14.F4(ADC_VREF/F4)
ADAPT_SIG: D1.C D2.C J1.SIG J2.SIG J3.SIG J4.SIG J5.SIG J6.SIG
AGND: C58.2 C59.2 C62.1 C63.1 C80.2 C81.2 C92.1 C93.1 JA.70 JB.70 JC.35 JC.70 JD.35 JD.70 L13.2 R67.1 R68.1 R93.1 R94.1 TP23.TP TP24.TP TP25.TP TP26.TP U20.M2(VESD) U20.M17(GND) U20.N1(GND) U20.N6(GND) U21.M2(VESD) U21.M17(GND) U21.N1(GND) U21.N6(GND) U28.M2(VESD) U28.M17(GND) U28.N1(GND) U28.N6(GND) U29.M2(VESD) U29.M17(GND) U29.N1(GND) U29.N6(GND)
ANT: C30.2 C31.2 J10.P$1
AUXIN1_A: JD.34 TP16.TP U20.N3(AUXIN1)
AUXIN1_B: JC.34 TP28.TP U28.N3(AUXIN1)
AUXIN1_C: JC.69 TP18.TP U21.N3(AUXIN1)
AUXIN1_D: JD.69 TP30.TP U29.N3(AUXIN1)
AUXIN2_A: JD.36 TP17.TP U20.N4(AUXIN2)
AUXIN2_B: JC.36 TP29.TP U28.N4(AUXIN2)
AUXIN2_C: TP19.TP U21.N4(AUXIN2)
AUXIN2_D: TP31.TP U29.N4(AUXIN2)
AUXIN3_C: TP20.TP U21.N5(AUXIN3)
AUXIN3_D: TP32.TP U29.N5(AUXIN3)
CONF_DONE: R89.2 U14.E6(DIFFIO_RX_T24N/CONF_DONE/E6)
CONFIG_SEL: R91.1 U14.D8(CONFIG_SEL/D8)
DAC_A_CS: U3.5(!SYNC) U14.G2(VREFB1N0/G2)
DAC_B_CS: U4.5(!SYNC) U14.J11(DIFFIO_RX_R10N/J11)
DIN0: U7.19(DIN0) U14.B11(DIFFIO_RX_T19N/B11)
DIN1: U7.20(DIN1) U14.B12(DIFFIO_RX_T19P/B12)
DIN2: U7.21(DIN2) U14.D11(DIFFIO_RX_T14P/D11)
DIN3: U7.22(DIN3) U14.A13(VREFB8N0/A13)
DIN4: U7.23(DIN4) U14.B13(DIFFIO_RX_T17P/B13)
DIN5: U7.24(DIN5) U14.A14(DIFFIO_RX_T17N/A14)
DIN6: U7.26(DIN6) U14.B14(DIFFIO_RX_T15N/B14)
DIN7: U7.27(DIN7) U14.B15(DIFFIO_RX_T15P/B15)
DIN8: U7.29(DIN8) U14.A9(DIFFIO_RX_T21P/A9)
DIN9: U7.30(DIN9) U14.A7(DIFFIO_RX_T23P/A7)
DIN10: U7.31(DIN10) U14.B8(DIFFIO_RX_T16N/DEV_CLRN/B8)
DIN11: U7.32(DIN11) U14.B7(DIFFIO_RX_T20P/B7)
DOUT_N: C29.2 U7.12(DOUT-)
DOUT_P: C28.2 U7.13(DOUT+)
E0A: JA.2 U20.K2(IN0)
E0B: JB.2 U28.K2(IN0)
E0C: JC.2 U21.K2(IN0)
E0D: JD.2 U29.K2(IN0)
E1A: JA.68 U20.J1(IN1)
E1B: JB.68 U28.J1(IN1)
E1C: JC.68 U21.J1(IN1)
E1D: JD.68 U29.J1(IN1)
E2A: JA.3 U20.J2(IN2)
E2B: JB.3 U28.J2(IN2)
E2C: JC.3 U21.J2(IN2)
E2D: JD.3 U29.J2(IN2)
E3A: JA.67 U20.H1(IN3)
E3B: JB.67 U28.H1(IN3)
E3C: JC.67 U21.H1(IN3)
E3D: JD.67 U29.H1(IN3)
E4A: JA.4 U20.H2(IN4)
E4B: JB.4 U28.H2(IN4)
E4C: JC.4 U21.H2(IN4)
E4D: JD.4 U29.H2(IN4)
E5A: JA.66 U20.G1(IN5)
E5B: JB.66 U28.G1(IN5)
E5C: JC.66 U21.G1(IN5)
E5D: JD.66 U29.G1(IN5)
E6A: JA.5 U20.G2(IN6)
E6B: JB.5 U28.G2(IN6)
E6C: JC.5 U21.G2(IN6)
E6D: JD.5 U29.G2(IN6)
E7A: JA.65 U20.F1(IN7)
E7B: JB.65 U28.F1(IN7)
E7C: JC.65 U21.F1(IN7)
E7D: JD.65 U29.F1(IN7)
E8A: JA.6 U20.F2(IN8)
E8B: JB.6 U28.F2(IN8)
E8C: JC.6 U21.F2(IN8)
E8D: JD.6 U29.F2(IN8)
E9A: JA.64 U20.E1(IN9)
E9B: JB.64 U28.E1(IN9)
E9C: JC.64 U21.E1(IN9)
E9D: JD.64 U29.E1(IN9)
E10A: JA.7 U20.E2(IN10)
E10B: JB.7 U28.E2(IN10)
E10C: JC.7 U21.E2(IN10)
E10D: JD.7 U29.E2(IN10)
E11A: JA.63 U20.D1(IN11)
E11B: JB.63 U28.D1(IN11)
E11C: JC.63 U21.D1(IN11)
E11D: JD.63 U29.D1(IN11)
E12A: JA.8 U20.D2(IN12)
E12B: JB.8 U28.D2(IN12)
E12C: JC.8 U21.D2(IN12)
E12D: JD.8 U29.D2(IN12)
E13A: JA.62 U20.C1(IN13)
E13B: JB.62 U28.C1(IN13)
E13C: JC.62 U21.C1(IN13)
E13D: JD.62 U29.C1(IN13)
E14A: JA.9 U20.C2(IN14)
E14B: JB.9 U28.C2(IN14)
E14C: JC.9 U21.C2(IN14)
E14D: JD.9 U29.C2(IN14)
E15A: JA.61 U20.B1(IN15)
E15B: JB.61 U28.B1(IN15)
E15C: JC.61 U21.B1(IN15)
E15D: JD.61 U29.B1(IN15)
E16A: JA.10 U20.A1(IN16)
E16B: JB.10 U28.A1(IN16)
E16C: JC.10 U21.A1(IN16)
E16D: JD.10 U29.A1(IN16)
E17A: JA.60 U20.B2(IN17)
E17B: JB.60 U28.B2(IN17)
E17C: JC.60 U21.B2(IN17)
E17D: JD.60 U29.B2(IN17)
E18A: JA.11 U20.A2(IN18)
E18B: JB.11 U28.A2(IN18)
E18C: JC.11 U21.A2(IN18)
E18D: JD.11 U29.A2(IN18)
E19A: JA.59 U20.B3(IN19)
E19B: JB.59 U28.B3(IN19)
E19C: JC.59 U21.B3(IN19)
E19D: JD.59 U29.B3(IN19)
E20A: JA.12 U20.A3(IN20)
E20B: JB.12 U28.A3(IN20)
E20C: JC.12 U21.A3(IN20)
E20D: JD.12 U29.A3(IN20)
E21A: JA.58 U20.B4(IN21)
E21B: JB.58 U28.B4(IN21)
E21C: JC.58 U21.B4(IN21)
E21D: JD.58 U29.B4(IN21)
E22A: JA.13 U20.A4(IN22)
E22B: JB.13 U28.A4(IN22)
E22C: JC.13 U21.A4(IN22)
E22D: JD.13 U29.A4(IN22)
E23A: JA.57 U20.B5(IN23)
E23B: JB.57 U28.B5(IN23)
E23C: JC.57 U21.B5(IN23)
E23D: JD.57 U29.B5(IN23)
E24A: JA.14 U20.A5(IN24)
E24B: JB.14 U28.A5(IN24)
E24C: JC.14 U21.A5(IN24)
E24D: JD.14 U29.A5(IN24)
E25A: JA.56 U20.B6(IN25)
E25B: JB.56 U28.B6(IN25)
E25C: JC.56 U21.B6(IN25)
E25D: JD.56 U29.B6(IN25)
E26A: JA.15 U20.A6(IN26)
E26B: JB.15 U28.A6(IN26)
E26C: JC.15 U21.A6(IN26)
E26D: JD.15 U29.A6(IN26)
E27A: JA.55 U20.B7(IN27)
E27B: JB.55 U28.B7(IN27)
E27C: JC.55 U21.B7(IN27)
E27D: JD.55 U29.B7(IN27)
E28A: JA.16 U20.A7(IN28)
E28B: JB.16 U28.A7(IN28)
E28C: JC.16 U21.A7(IN28)
E28D: JD.16 U29.A7(IN28)
E29A: JA.54 U20.B8(IN29)
E29B: JB.54 U28.B8(IN29)
E29C: JC.54 U21.B8(IN29)
E29D: JD.54 U29.B8(IN29)
E30A: JA.17 U20.A8(IN30)
E30B: JB.17 U28.A8(IN30)
E30C: JC.17 U21.A8(IN30)
E30D: JD.17 U29.A8(IN30)
E31A: JA.53 U20.B9(IN31)
E31B: JB.53 U28.B9(IN31)
E31C: JC.53 U21.B9(IN31)
E31D: JD.53 U29.B9(IN31)
E32A: JA.18 U20.A9(IN32)
E32B: JB.18 U28.A9(IN32)
E32C: JC.18 U21.A9(IN32)
E32D: JD.18 U29.A9(IN32)
E33A: JA.52 U20.A10(IN33)
E33B: JB.52 U28.A10(IN33)
E33C: JC.52 U21.A10(IN33)
E33D: JD.52 U29.A10(IN33)
E34A: JA.19 U20.B10(IN34)
E34B: JB.19 U28.B10(IN34)
E34C: JC.19 U21.B10(IN34)
E34D: JD.19 U29.B10(IN34)
E35A: JA.51 U20.A11(IN35)
E35B: JB.51 U28.A11(IN35)
E35C: JC.51 U21.A11(IN35)
E35D: JD.51 U29.A11(IN35)
E36A: JA.20 U20.B11(IN36)
E36B: JB.20 U28.B11(IN36)
E36C: JC.20 U21.B11(IN36)
E36D: JD.20 U29.B11(IN36)
E37A: JA.50 U20.A12(IN37)
E37B: JB.50 U28.A12(IN37)
E37C: JC.50 U21.A12(IN37)
E37D: JD.50 U29.A12(IN37)
E38A: JA.21 U20.B12(IN38)
E38B: JB.21 U28.B12(IN38)
E38C: JC.21 U21.B12(IN38)
E38D: JD.21 U29.B12(IN38)
E39A: JA.49 U20.A13(IN39)
E39B: JB.49 U28.A13(IN39)
E39C: JC.49 U21.A13(IN39)
E39D: JD.49 U29.A13(IN39)
E40A: JA.22 U20.B13(IN40)
E40B: JB.22 U28.B13(IN40)
E40C: JC.22 U21.B13(IN40)
E40D: JD.22 U29.B13(IN40)
E41A: JA.48 U20.A14(IN41)
E41B: JB.48 U28.A14(IN41)
E41C: JC.48 U21.A14(IN41)
E41D: JD.48 U29.A14(IN41)
E42A: JA.23 U20.B14(IN42)
E42B: JB.23 U28.B14(IN42)
E42C: JC.23 U21.B14(IN42)
E42D: JD.23 U29.B14(IN42)
E43A: JA.47 U20.A15(IN43)
E43B: JB.47 U28.A15(IN43)
E43C: JC.47 U21.A15(IN43)
E43D: JD.47 U29.A15(IN43)
E44A: JA.24 U20.B15(IN44)
E44B: JB.24 U28.B15(IN44)
E44C: JC.24 U21.B15(IN44)
E44D: JD.24 U29.B15(IN44)
E45A: JA.46 U20.A16(IN45)
E45B: JB.46 U28.A16(IN45)
E45C: JC.46 U21.A16(IN45)
E45D: JD.46 U29.A16(IN45)
E46A: JA.25 U20.B16(IN46)
E46B: JB.25 U28.B16(IN46)
E46C: JC.25 U21.B16(IN46)
E46D: JD.25 U29.B16(IN46)
E47A: JA.45 U20.A17(IN47)
E47B: JB.45 U28.A17(IN47)
E47C: JC.45 U21.A17(IN47)
E47D: JD.45 U29.A17(IN47)
E48A: JA.26 U20.B17(IN48)
E48B: JB.26 U28.B17(IN48)
E48C: JC.26 U21.B17(IN48)
E48D: JD.26 U29.B17(IN48)
E49A: JA.44 U20.C16(IN49)
E49B: JB.44 U28.C16(IN49)
E49C: JC.44 U21.C16(IN49)
E49D: JD.44 U29.C16(IN49)
E50A: JA.27 U20.C17(IN50)
E50B: JB.27 U28.C17(IN50)
E50C: JC.27 U21.C17(IN50)
E50D: JD.27 U29.C17(IN50)
E51A: JA.43 U20.D16(IN51)
E51B: JB.43 U28.D16(IN51)
E51C: JC.43 U21.D16(IN51)
E51D: JD.43 U29.D16(IN51)
E52A: JA.28 U20.D17(IN52)
E52B: JB.28 U28.D17(IN52)
E52C: JC.28 U21.D17(IN52)
E52D: JD.28 U29.D17(IN52)
E53A: JA.42 U20.E16(IN53)
E53B: JB.42 U28.E16(IN53)
E53C: JC.42 U21.E16(IN53)
E53D: JD.42 U29.E16(IN53)
E54A: JA.29 U20.E17(IN54)
E54B: JB.29 U28.E17(IN54)
E54C: JC.29 U21.E17(IN54)
E54D: JD.29 U29.E17(IN54)
E55A: JA.41 U20.F16(IN55)
E55B: JB.41 U28.F16(IN55)
E55C: JC.41 U21.F16(IN55)
E55D: JD.41 U29.F16(IN55)
E56A: JA.30 U20.F17(IN56)
E56B: JB.30 U28.F17(IN56)
E56C: JC.30 U21.F17(IN56)
E56D: JD.30 U29.F17(IN56)
E57A: JA.40 U20.G16(IN57)
E57B: JB.40 U28.G16(IN57)
E57C: JC.40 U21.G16(IN57)
E57D: JD.40 U29.G16(IN57)
E58A: JA.31 U20.G17(IN58)
E58B: JB.31 U28.G17(IN58)
E58C: JC.31 U21.G17(IN58)
E58D: JD.31 U29.G17(IN58)
E59A: JA.39 U20.H16(IN59)
E59B: JB.39 U28.H16(IN59)
E59C: JC.39 U21.H16(IN59)
E59D: JD.39 U29.H16(IN59)
E60A: JA.32 U20.H17(IN60)
E60B: JB.32 U28.H17(IN60)
E60C: JC.32 U21.H17(IN60)
E60D: JD.32 U29.H17(IN60)
E61A: JA.38 U20.J16(IN61)
E61B: JB.38 U28.J16(IN61)
E61C: JC.38 U21.J16(IN61)
E61D: JD.38 U29.J16(IN61)
E62A: JA.33 U20.J17(IN62)
E62B: JB.33 U28.J17(IN62)
E62C: JC.33 U21.J17(IN62)
E62D: JD.33 U29.J17(IN62)
E63A: JA.37 U20.K16(IN63)
E63B: JB.37 U28.K16(IN63)
E63C: JC.37 U21.K16(IN63)
E63D: JD.37 U29.K16(IN63)
ESTIM_POW_EN: R82.1 U14.K4(DIFFIO_RX_L20P/CLK1P/K4) U24.8(!SHDN2) U24.9(!SHDN1)
EXP1: J11.13 U14.D2(DIFFIO_RX_L1N/ADCIN1/D2)
EXP2: J11.2 U14.C2(DIFFIO_RX_L1P/ADCIN2/C2)
EXP3: J11.8 U14.F5(DIFFIO_RX_L3N/ADCIN3/F5)
EXP4: J11.10 U14.G5(DIFFIO_RX_L3P/ADCIN4/G5)
EXP5/VMEAS: J11.1 R49.1 U14.C1(DIFFIO_RX_L5N/ADCIN5/C1)
EXP6: J11.14 U14.B1(DIFFIO_RX_L5P/ADCIN6/B1)
EXP7: J11.3 U14.E1(DIFFIO_RX_L7N/ADCIN7/E1)
EXP8: J11.15 U14.E2(DIFFIO_RX_L7P/ADCIN8/E2)
EXP9: J12.5 U14.R7(DIFFIO_RX_B6N/R7)
EXP10: J12.4 U14.P8(DIFFIO_RX_B6P/P8)
EXP11: J12.2 U14.M8(DIFFIO_TX_RX_B9N/M8)
EXP12: J12.1 U14.R11(VREFB3N0/R11)
EXP13: J12.3 U14.N8(DIFFIO_TX_RX_B9P/N8)
EXP14: J12.6 U14.P12
FB1: R61.1 R64.2 U19.10(FB)
GND: C1.2 C2.2 C3.2 C4.2 C5.2 C6.2 C7.2 C8.2 C9.2 C10.2 C11.2 C12.2 C13.2 C14.2 C15.2 C16.2 C17.2 C18.2 C19.2 C20.2 C21.2 C22.2 C23.2 C24.2 C25.2 C26.2 C27.2 C31.1 C32.2 C33.2 C34.2 C35.2 C36.2 C37.2 C38.2 C39.2 C40.2 C41.2 C42.2 C43.2 C44.2 C45.2 C46.2 C47.2 C48.1 C49.2 C50.2 C51.2 C53.2 C54.2 C55.2 C56.2 C57.2 C60.2 C61.2 C64.2 C65.2 C66.2 C67.2 C70.2 C71.2 C72.2 C73.2 C74.2 C75.2 C76.2 C77.2 C78.2 C79.2 C82.2 C83.2 C84.2 C85.2 C86.2 C87.2 C88.2 C89.2 C90.2 C91.2 C94.2 C95.2 C96.2 C97.2 C98.2 C99.2 C100.2 C101.2 C102.2 C103.2 GND.TP J9.GND1 J9.GND2 J9.GND3 J9.GND4 J10.P$2 J10.P$3 J10.P$4 J11.4 J11.7 J11.9 J11.11 J11.12 J11.16 J11.M1 J11.M2 J11.M3 J11.M4 J12.9 J12.10 J12.M1 J12.M2 J12.M3 J12.M4 J13.2 J13.M2 L10.1 L13.1 R29.1 R30.1 R33.1 R34.1 R35.1 R39.2 R40.2 R41.2 R44.2 R51.1 R56.1 R58.1 R59.2 R63.1 R64.1 R70.1 R78.1 R80.1 R82.2 R86.1 R90.1 R91.2 R92.1 R98.1 TP7.1(TP) TP8.1(TP) TP9.1(TP) TP12.1(TP) U3.3(GND) U3.PAD(GND) U4.3(GND) U4.PAD(GND) U5.2(X0) U5.13(GND) U5.14(B) U6.2(X0) U6.3(X1) U6.13(GND) U6.14(B) U7.6(ID) U7.7(RES) U7.PAD(GND) U8.8(VSS) U8.14(VSS) U8.17(VSS) U8.20(VSS) U9.1(GND) U9.PAD(GND) U10.1(GND) U10.PAD(GND) U11.4(GND) U11.8(LA) U12.4(GND) U12.8(LA) U13.G1(GND) U13.G2(GND) U13.G3(POL) U13.VSS(GND) U14.A1(GND) U14.A15(GND) U14.B2(GND) U14.D5(GND) U14.D9(GND) U14.E5(GND) U14.E12(GND) U14.G4(GND) U14.G9(GND) U14.H8(GND) U14.H14(GND) U14.J7(GND) U14.L12(GND) U14.M2(GND) U14.M6(GND) U14.M10(GND) U14.R1(GND) U14.R15(GND) U16.A1(CTG) U16.A4(GND) U17.2(GND) U17.5(PS1) U17.6(PS0) U17.15(GNDIO) U17.16(GNDIO) U17.17(COM3/ADDR) U17.18(COM2) U17.25(GNDIO) U18.2(GND) U19.4(PGND) U19.9(GND) U19.PAD1(PGND) U19.PAD2(PGND) U19.PAD3(PGND) U19.PAD4(PGND) U19.PAD(PGND) U22.B2(AVSS) U22.B3(AVSS2) U23.B2(AVSS) U23.B3(AVSS2) U24.PAD(GND) U25.B2(AVSS) U25.B3(AVSS2) U26.2(GND) U26.PAD(GND) U27.B2(AVSS) U27.B3(AVSS2) U30.5(AGND) U30.8(PGND) U31.B2(AVSS) U31.B3(AVSS2) U32.B2(AVSS) U32.B3(AVSS2) U33.C1(GND) U33.C2(GND) U33.C3(GND) Y1.2(CAN) Y1.4(CAN)
GND1: D1.A D2.A J1.GND1 J1.GND2 J1.GND3 J1.GND4 J2.GND1 J2.GND2 J2.GND3 J2.GND4 J3.G1 J3.G2 J3.G3 J3.G4 J4.GND1 J4.GND2 J4.GND3 J4.GND5 J4.GND6 J4.GND7 J4.GND9 J4.GND12 J5.GND@1 J5.GND@2 J5.GND@3 J5.GND@4 J6.GND1 J6.GND2 J6.GND3 J6.GND5 J6.GND6 J6.GND7 J6.GND9 J6.GND12 J7.GND1 J7.GND2 J7.GND3 J7.GND4 J8.GND1 J8.GND2 J8.GND3 J8.GND4
HSYNC: U7.1(HSYNC) U14.A5(DIFFIO_RX_T23N/A5)
IMEAS_A: R19.1 R29.2 U20.N5(AUXIN3)
IMEAS_B: R20.1 R30.2 U28.N5(AUXIN3)
IMU_BL_IND: TP13.TP U17.10(BL_IND)
IMU_INT: U14.R5(DIFFIO_RX_B4P/R5) U17.14(INT)
INTAN_EN: U14.K2(DIFFIO_RX_L16P/K2) U26.3(EN)
INTAN_VDD: C62.2 C63.2 C92.2 C93.2 R72.1 R75.2 U20.M15(VDD) U20.M16(LVDS_EN) U20.N2(VDD) U20.N15(VDD) U21.M15(VDD) U21.M16(LVDS_EN) U21.N2(VDD) U21.N15(VDD) U28.M15(VDD) U28.M16(LVDS_EN) U28.N2(VDD) U28.N15(VDD) U29.M15(VDD) U29.M16(LVDS_EN) U29.N2(VDD) U29.N15(VDD)
ISTIM_A: JA.69 U5.6(X) U5.10(Y1)
ISTIM_A_PRE: R15.1 U1.9(C:+IN) U5.7(Y)
ISTIM_B: JB.69 U6.6(X) U6.10(Y1)
ISTIM_B_PRE: R17.1 U2.9(C:+IN) U6.7(Y)
JTAGEN: R52.2 U14.G7(JTAGEN/G7)
LED_BLANK: U9.21(BLANK) U10.21(BLANK) U14.G15(DIFFIO_RX_R18N/G15)
LED_CAT0_A: JA.34 U9.5(LED1) U9.6(LED2) U9.7(LED3) U9.8(LED4) U9.9(LED5) U9.10(LED6) U9.11(LED7) U9.12(LED8)
LED_CAT0_B: JB.34 U10.5(LED1) U10.6(LED2) U10.7(LED3) U10.8(LED4) U10.9(LED5) U10.10(LED6) U10.11(LED7) U10.12(LED8)
LED_CAT1_A: JA.35 U9.13(LED9) U9.14(LED10) U9.15(LED11) U9.16(LED12) U9.17(LED13) U9.18(LED14) U9.19(LED15) U9.20(LED16)
LED_CAT1_B: JB.35 U10.13(LED9) U10.14(LED10) U10.15(LED11) U10.16(LED12) U10.17(LED13) U10.18(LED14) U10.19(LED15) U10.20(LED16)
LED_CLK: U9.3(CLK) U10.3(CLK) U14.E11(DIFFIO_RX_R33P/E11)
LED_LATCH: U9.4(LATCH) U10.4(LATCH) U14.E14
LED_SIN: U10.2(SIN) U14.D12(DIFFIO_RX_R33N/D12)
LH_DATA1: TP15.TP U14.C14(DIFFIO_RX_R28N/C14) U22.C1(D/CFGDATA)
LH_DATA2: U14.P2(DIFFIO_RX_L27P/PLL_L_CLKOUTP/P2) U23.C1(D/CFGDATA)
LH_DATA3: U14.L15(VREFB5N0/L15) U25.C1(D/CFGDATA)
LH_DATA4: U14.J15(DIFFIO_RX_R18P/J15) U27.C1(D/CFGDATA)
LH_DATA5: U14.J2(DIFFIO_RX_L14P/J2) U31.C1(D/CFGDATA)
LH_DATA6: U14.F11(DIFFIO_RX_R27P/F11) U32.C1(D/CFGDATA)
LH_ENV1: TP14.TP U14.C15(DIFFIO_RX_R28P/C15) U22.C2(E/CFGCLK)
LH_ENV2: U14.R2 U23.C2(E/CFGCLK)
LH_ENV3: U14.M14 U25.C2(E/CFGCLK)
LH_ENV4: U14.J14(DIFFIO_RX_R11N/J14) U27.C2(E/CFGCLK)
LH_ENV5: U14.J4(DIFFIO_RX_L18N/CLK0N/J4) U31.C2(E/CFGCLK)
LH_ENV6: U14.F12(DIFFIO_RX_R27N/F12) U32.C2(E/CFGCLK)
LIPO_QSTRT: R56.2 U14.A2(DIFFIO_RX_T26P/A2) U16.B3(QSTRT)
MAIN_SUPPLY: C24.1 C25.1 L3.1 L5.2 R32.2
MIDFILT: L4.2 L5.1 R31.2 R32.1
MOSI: U3.6(DIN) U4.6(DIN) U11.2(DIN) U12.2(DIN) U14.J12(DIFFIO_RX_R14P/CLK2P/J12)
N$1: C58.1 U20.N17(ADC_REF)
N$2: C80.1 U28.N17(ADC_REF)
N$3: D9.C U25.A3(IIN-)
N$4: C59.1 U21.N17(ADC_REF)
N$5: D9.A U25.A2(IIN+)
N$6: C81.1 U29.N17(ADC_REF)
N$7: R86.2 U25.B1(RBIAS)
N$8: C72.1 U25.A1(AVDD)
N$9: D3.A R58.2 U15.1(G)
N$10: C69.1 L14.1 U24.4(SW2)
N$11: L12.1 U24.2(SW1)
N$12: C69.2 D8.C U24.5(D2)
N$13: D5.C U23.A3(IIN-)
N$14: D5.A U23.A2(IIN+)
N$15: C68.1 R81.1 R85.2 U24.6(FB2)
N$16: R81.2 U24.7(VREF)
N$17: C50.1 U17.26(XOUT32) Y2.P$2
N$18: J13.1 J13.M1 TP10.1(TP) U15.2(D) U15.3(D)
N$19: R80.2 U23.B1(RBIAS)
N$20: C67.1 U23.A1(AVDD)
N$21: C49.1 U17.27(XIN32) Y2.P$1
N$22: U14.J5(DIFFIO_RX_L18P/CLK0P/J5) U18.3(OUT)
N$23: TP21.TP U20.N16(AUXOUT)
N$24: R74.1 R78.2 U24.10(FB1)
N$25: D4.C U22.A3(IIN-)
N$26: D4.A U22.A2(IIN+)
N$27: R70.2 U22.B1(RBIAS)
N$28: C61.1 U22.A1(AVDD)
N$29: L11.1 U19.3(L)
N$30: C57.1 U19.1(VAUX)
N$31: R36.2 U5.16(EN)
N$32: TP34.TP U28.N16(AUXOUT)
N$33: D10.C U27.A3(IIN-)
N$34: D10.A U27.A2(IIN+)
N$35: R90.2 U27.B1(RBIAS)
N$36: C76.1 U27.A1(AVDD)
N$37: C38.1 R43.1 U8.9(XC2) Y1.1
N$38: C39.1 R43.2 U8.10(XC1) Y1.3
N$40: TP22.TP U21.N16(AUXOUT)
N$41: R37.2 U6.16(EN)
N$42: R44.1 U8.16(IREF)
N$43: L6.1 L8.2 U8.13(ANT2)
N$44: R2.1 R6.2 U2.2(A:+IN)
N$45: R10.2 R22.1 U2.1(A:-IN)
N$46: C29.1 R33.2
N$47: R42.2 U7.9(PDB)
N$48: R38.2 R41.1 U7.8(MODE)
N$49: C3.1 C4.1 C5.1 L1.2 U7.10(VDDPLL)
N$50: C19.1 C20.1 C21.1 L2.2 U7.14(VDDCML)
N$51: R2.2 R4.2 R17.2 U2.4(B:+IN)
N$52: R48.2 R49.2 R51.2
N$53: R24.1 R27.2 U2.6(B:OUT)
N$54: R1.1 R5.2 U1.2(A:+IN)
N$55: R34.2 U5.11(Y0)
N$56: R46.2 U11.6(WA)
N$57: R46.1 U9.23(RSET)
N$58: R3.1 R21.2 U1.15(A:OUT)
N$59: R4.1 R22.2 U2.15(A:OUT)
N$61: R7.2 R21.1 U1.1(A:-IN)
N$62: R35.2 U6.11(Y0)
N$63: R47.2 U12.6(WA)
N$64: R47.1 U10.23(RSET)
N$65: L8.1 L9.2 U8.12(ANT1)
N$66: C30.1 L6.2
N$67: C48.2 U17.9(CAP)
N$68: R1.2 R3.2 R15.2 U1.4(B:+IN)
N$70: U9.2(SIN) U10.22(SOUT)
N$72: C34.1 U8.19(DVDD)
N$73: R23.1 R25.2 U1.6(B:OUT)
N$74: R16.1 R23.2 U1.5(B:-IN)
N$75: R13.1 R16.2 U1.8(C:-IN)
N$76: R8.2 R13.2 U1.7(C:OUT)
N$77: R9.1 R19.2 U1.14(D:OUT)
N$78: R8.1 R9.2 U1.12(D:-IN)
N$79: R25.1 R26.2 U1.11(D:+IN)
N$80: R18.1 R24.2 U2.5(B:-IN)
N$81: R14.1 R18.2 U2.8(C:-IN)
N$82: R11.2 R14.2 U2.7(C:OUT)
N$83: TP35.1(TP) U32.A3(IIN-)
N$84: TP36.1(TP) U32.A2(IIN+)
N$85: R98.2 U32.B1(RBIAS)
N$86: R12.1 R20.2 U2.14(D:OUT)
N$87: R11.1 R12.2 U2.12(D:-IN)
N$88: R27.1 R28.2 U2.11(D:+IN)
N$89: C103.1 U32.A1(AVDD)
N$92: D6.2(A) R83.2
N$93: D7.2(A) R84.2
N$94: L16.2 U30.1(SW) U30.2(SW)
N$97: D11.C TP27.1(TP) U31.A3(IIN-)
N$98: D11.A TP33.1(TP) U31.A2(IIN+)
N$99: R92.2 U31.B1(RBIAS)
N$100: C82.1 U31.A1(AVDD)
NCONFIG: R87.2 U14.E8(NCONFIG/E8)
NRF_CS: U8.2(CSN) U14.K12(DIFFIO_RX_R7N/K12)
NRF_EN: U8.1(CE) U14.K14(DIFFIO_RX_R11P/K14)
NRF_IRQ: U8.6(!IRQ) U14.J9(DIFFIO_RX_R10P/J9)
NRF_MISO: U8.5(MISO) U14.M12(DIFFIO_RX_R1P/M12)
NRF_MOSI: U8.4(MOSI) U14.N14(DIFFIO_RX_R2N/N14)
NRF_SCLK: U8.3(SCK) U14.N15(DIFFIO_RX_R2P/N15)
NSTATUS: R88.2 U14.D6(DIFFIO_RX_T24P/NSTATUS/D6)
OUT [thick]: L15.2 U26.1(OUT)
PCLK: U7.3(PCLK1) U14.C8(DIFFIO_RX_T16P/C8)
POTA_CS: U11.3(!CS) U14.H3(DIFFIO_RX_L14N/H3)
POTB_CS: U12.3(!CS) U14.E15(VREFB6N0/E15)
REF_A: JA.1 R67.2 U20.M1(REF_ELEC)
REF_B: JB.1 R93.2 U28.M1(REF_ELEC)
REF_C: JC.1 R68.2 U21.M1(REF_ELEC)
REF_D: JD.1 R94.2 U29.M1(REF_ELEC)
REFGND: L10.2 U14.E4(REFGND/E4)
RHD_CLK+_AC: R73.2 U14.L7(DIFFIO_TX_RX_B3P/L7) U20.N10(SCLK+) U21.N10(SCLK+)
RHD_CLK+_BD: R96.2 U14.M9(DIFFIO_TX_RX_B12P/M9) U28.N10(SCLK+) U29.N10(SCLK+)
RHD_CLK-_AC: R73.1 U14.L6(DIFFIO_TX_RX_B3N/L6) U20.N9(SCLK-) U21.N9(SCLK-)
RHD_CLK-_BD: R96.1 U14.L9(DIFFIO_TX_RX_B12N/L9) U28.N9(SCLK-) U29.N9(SCLK-)
RHD_CS+_AC: R69.2 U14.M5(DIFFIO_TX_RX_B1P/M5) U20.N8(!CS!+) U21.N8(!CS!+)
RHD_CS+_BD: R95.2 U14.R13(DIFFIO_TX_RX_B16P/R13) U28.N8(!CS!+) U29.N8(!CS!+)
RHD_CS-_AC: R69.1 U14.M4(DIFFIO_TX_RX_B1N/M4) U20.N7(!CS!-) U21.N7(!CS!-)
RHD_CS-_BD: R95.1 U14.P14(DIFFIO_TX_RX_B16N/P14) U28.N7(!CS!-) U29.N7(!CS!-)
RHD_MISO+_A: R62.2 U14.R3(DIFFIO_RX_B2P/R3) U20.N14(MISO+)
RHD_MISO+_B: R71.1 U14.P15(DIFFIO_TX_RX_B10P/P15) U28.N14(MISO+)
RHD_MISO+_C: R65.1 U14.M7(DIFFIO_TX_RX_B7P/M7) U21.N14(MISO+)
RHD_MISO+_D: R66.1 U14.R9(DIFFIO_RX_B8P/R9) U29.N14(MISO+)
RHD_MISO-_A: R62.1 U14.P3(DIFFIO_RX_B2N/P3) U20.N13(MISO-)
RHD_MISO-_B: R71.2 U14.R14(DIFFIO_TX_RX_B10N/R14) U28.N13(MISO-)
RHD_MISO-_C: R65.2 U14.L8(DIFFIO_TX_RX_B7N/L8) U21.N13(MISO-)
RHD_MISO-_D: R66.2 U14.P9(DIFFIO_RX_B8N/P9) U29.N13(MISO-)
RHD_MOSI+_AC: R79.2 U14.P7(DIFFIO_TX_RX_B5P/P7) U20.N12(MOSI+) U21.N12(MOSI+)
RHD_MOSI+_BD: R97.2 U14.M11(DIFFIO_TX_RX_B14P/M11) U28.N12(MOSI+) U29.N12(MOSI+)
RHD_MOSI-_AC: R79.1 U14.P6(DIFFIO_TX_RX_B5N/P6) U20.N11(MOSI-) U21.N11(MOSI-)
RHD_MOSI-_BD: R97.1 U14.L10(DIFFIO_TX_RX_B14N/L10) U28.N11(MOSI-) U29.N11(MOSI-)
SCL: R76.1 U14.K11(DIFFIO_RX_R7P/K11) U16.B2(SCL) U17.19(COM1/SCL/RX)
SCLK: U3.4(SCLK) U4.4(SCLK) U11.5(SCLK) U12.5(SCLK) U14.H13(DIFFIO_RX_R16N/CLK3N/H13)
SD_CS: U13.CD/DATA3(DAT3/!CS) U14.L1(DIFFIO_RX_L16N/L1)
SD_DAT2: U13.DAT2 U14.K5(DIFFIO_RX_L20N/CLK1N/K5)
SD_DET: R45.1 U13.G4(DET)
SD_IRQ: U13.DAT1(DAT1/!IRQ) U14.P1(VREFB2N0/P1)
SD_MISO: U13.DAT0(DAT0/MISO) U14.N1(DIFFIO_RX_L27N/PLL_L_CLKOUTN/N1)
SD_MOSI: U13.CMD(CMD/MOSI) U14.L4(DIFFIO_RX_L22P/DPCLK1/L4)
SD_SCLK: U13.CLK(CLK/SLCK) U14.L5(DIFFIO_RX_L22N/DPCLK0/L5)
SDA: R77.1 U14.L11(DIFFIO_RX_R1N/L11) U16.B1(SDA) U17.20(COM0/SDA/TX)
SERDES_EN: U14.D7(DIFFIO_RX_T22P/D7) U33.B2(EN)
SERDES_GPIO0: TP1.1(TP) U7.15(GPIO0) U14.E9(DIFFIO_RX_T18N/E9)
SERDES_GPIO1: TP2.1(TP) U7.16(GPIO1) U14.D10(DIFFIO_RX_T14N/D10)
SERDES_GPIO2: TP3.1(TP) U7.17(GPIO2/CLKOUT) U14.E10(DIFFIO_RX_T18P/DEV_OE/E10)
SERDES_GPIO3: TP4.1(TP) U7.18(GPO3/CLKIN) U14.A11(DIFFIO_RX_T21N/A11)
SERDES_SCL: U7.4(SCL) U14.B4
SERDES_SDA: U7.5(SDA) U14.B6(DIFFIO_RX_T20N/B6)
SIGOUT: C28.1 J9.SIG L4.1 R31.1
STATUS_A: D7.1(C) U14.G11(DIFFIO_RX_R26P/DPCLK3/G11)
STATUS_B: D6.1(C) U14.G12(DIFFIO_RX_R26N/DPCLK2/G12)
STIM_NULL_A: R39.1 U5.15(A) U14.H11(DIFFIO_RX_R14N/CLK2N/H11)
STIM_NULL_B: R40.1 U6.15(A) U14.H12(DIFFIO_RX_R16P/CLK3P/H12)
TCK: R59.1 TCK.TP U14.J1(DIFFIO_RX_L11P/TCK/J1)
TDI: R54.2 TDI.TP U14.H5(DIFFIO_RX_L12N/TDI/H5)
TDO: TDO.TP U14.H4(DIFFIO_RX_L12P/TDO/H4)
TMS: R53.2 TMS.TP U14.G1(DIFFIO_RX_L11N/TMS/G1)
UVLO: C52.2 R60.1 R63.2 U19.7(UVLO)
V_LIPO: C44.1 C52.1 C53.1 C54.1 D3.C L11.2 R60.2 U15.4(S) U16.A2(CELL) U16.A3(VDD) U19.5(VI) U19.6(EN) U19.8(PS)
VCCA: C94.1 C95.1 C96.1 C97.1 L19.2 U14.B3(VCCA3/B3) U14.D14(VCCA2/D14) U14.N2(VCCA1/N2) U14.P13(VCCA4/P13)
VCCIO: C83.1 C84.1 C85.1 C86.1 C87.1 L17.2 U14.B5(VCCIO8/B9,B5,B10) U14.B9(VCCIO8/B9,B5,B10) U14.B10(VCCIO8/B9,B5,B10) U14.F14(VCCIO6/G14,F14) U14.G14(VCCIO6/G14,F14) U14.H2(VCCIO1B/H2) U14.L2(VCCIO2/L2) U14.L14(VCCIO5/L14) U14.P5(VCCIO3/P5,P11,P10) U14.P10(VCCIO3/P5,P11,P10) U14.P11(VCCIO3/P5,P11,P10)
VCCIOA: C88.1 C89.1 C90.1 C91.1 L18.2 U14.F2(VCCIO1A/F2)
VCOAX: C6.1 C8.1 C37.1 C40.1 C55.1 C56.1 C64.1 C73.1 C78.1 J11.19 J11.20 JA.36 JB.36 L3.2 L12.2 L14.2 R48.1 R61.2 TP5.1(TP) U3.1(AVDD) U4.1(AVDD) U9.24(VDD) U10.24(VDD) U19.2(VO) U24.3(VIN) U26.4(IN) U30.3(EN) U30.6(VIN) U30.7(VIN) U33.A3(VIN) U33.B1(MODE) U33.B3(VIN) VCOAX.TP ; supply symbol labelled +VCOAX
VDAC_A: R5.1 U3.8(VOUT)
VDAC_B: R6.1 U4.8(VOUT)
VDD_NRF: C32.1 C33.1 L7.1 U8.7(VDD) U8.15(VDD) U8.18(VDD)
VDD_PA: C35.1 C36.1 L9.1 U8.11(VDD_PA)
VREF_2V5_A: R7.1 R26.1 U3.7(VREF)
VREF_2V5_B: R10.1 R28.1 U4.7(VREF)
VSYNC: U7.2(VSYNC) U14.A3(DIFFIO_RX_T26N/A3)
Unconnected: U5.3(X1) U5.4(X2) U5.5(X3) U5.8(Y3) U5.9(Y2) U6.4(X2) U6.5(X3) U6.8(Y3) U6.9(Y2) U9.22(SOUT) U11.1(HA) U12.1(HA) U17.1(RESV(DNC)) U17.7(RESV(DNC)) U17.8(RESV(DNC)) U17.12(RESV(DNC)) U17.13(RESV(DNC)) U17.21(RESV(DNC)) U17.22(RESV(DNC)) U17.23(RESV(DNC)) U17.24(RESV(DNC)) U20.L17(ELEC_TEST) U21.L17(ELEC_TEST) U28.L17(ELEC_TEST) U29.L17(ELEC_TEST) U29.N16(AUXOUT)

## Buses
DIN[0..11],HSYNC,VSYNC,PCLK

## Notes on the sheet
- DAUGHER BOARDS
- ESTIM
- EXPANSION
  & TESTPOINTS
- SMA | MMCX
- TETHERED IO
- NB: VCoax must NOT exceed 5.5V
- NB: GND for ease 
  of routing.
- SERIALIZER
- NB:
  ISTIM = (VDAC  - 2.5)/1000.
  e.g. 
  VDAC = 2.5   -> ISTIM = 0
  VDAC = 5.0   -> ISTIM = 2.5 mA
  VDAC = 0.0   -> ISTIM = -2.5mA
  
  and
  
  Imeas = 400 * ISTIM + 1.25V
  e.g. 
  ISTIM = 0          -> IMEAS = 1.25V
  ISTIM = 2.5mA  -> IMEAS = 2.25V
  ISTIM = -2.5mA -> IMEAS = 0.25V
- WIRELESS IO | LOGGER | OPTOSTIM
- Analog Ref
  - Internal VREF = 3.3V
- FPGA
- North-East
- EPHYS | 9DOF TRACKING | POWER
- North
- Programming interface
- North-West | NB: CLK2 drives PLL1
- I2C Selected
- NB To get the best performance out
  of BNO055, it is recommended to use
  the external 32.768 kHz crystal.
- A | C
- West
- NB: Lockout @ 2.3V,
  which is min. 
  programmable of 
  MAX17048
- LVDS  Differential I/O Standard requires VIO = 2.5V
  Bank 3 is the only on with non-emulated LVDS
- South-West
- NB: I2C Addresses
  - 0x6C: write to MAX17048
  - 0x6D: read from MAX17048
  - 0x28: BNO055
- South-East
- NB: Inductors pass 250mA DC max
  before they are used to generate a
  flyback voltage. Because we are
  dealing with a very low current
  application, we can probably get 
  away with inductors that saturate
  below 250 mA so long as they are
  capable of handling the current. 
  The MLZ2012M100WT000 saturates 
  at 200 mA, and provides a sheild. 
  The CBC2012T100M saturates at
  240mA and provides no shield.
- East
- NB: Switching residue
  filter.
- NB: Worst case 
  current consumption
  is ~80 mA for 4 chips.
- B | D
- Load will never be 
  small enough that 
  ECO matters and 
  forcing PWM gives 
  better ripple.
- NB: Supply voltage 
  for input and 
  output buffers.
  All IO is single
  ended LVCMOS.
  No individual
  VREFs are needed.
- NB: Ths BLM has higher 
  current rating than the 
  others!
- NB: 0.1 is not needed.
- NB: Supply voltage 
  for PLL regulator 
  and ADC block 
  (analog). Also 
  determines ADC 
  max voltage. Use
  3.3V.
- NB: Core logic is 
  LDOed from 
  VCC_ONE

## Library data of the parts
3V1 GND TCK TDI TDO TMS TP1-TP36 VCOAX = jonnew:TP: Test pad
C1 C2 = jonnew:C: Capacitor; PARTNP: CL03A104KA3NNNC
C3 C4 C12-C15 C17-C20 C30-C36 C38 C39 C43 C45 C47 C49-C57 C62 C63 C68 C77 C78 C83-C97 C99-C102 = jonnew:C: Capacitor
C5 C16 = jonnew:C: Capacitor; PARTNO: GRM155R61A475MEAAD
C6-C9 C24 C41 C42 C48 C60 C66 C71 C75 C79 C98 = jonnew:C: Capacitor; PARTNO: C0603X5R1C104K030BC
C10 C11 C22 C23 C26 C27 C44 = jonnew:C: Capacitor; PARTNO: CL03A104KA3NNNC
C21 = jonnew:C: Capacitor; PARTNO: CL05A226MQ5QUNC
C25 = jonnew:C: Capacitor; PARTNO: CL05A475MO5NUNC
C28 = jonnew:C: Capacitor; PARTNO: C1005X7R1H104K050BB
C29 = jonnew:C: Capacitor; PARTNO: C1005X7R1H473K050BB
C37 C40 C64 C69 C73 = jonnew:C: Capacitor; PARTNO: CL05A105KO5NNNC
C46 = jonnew:C: Capacitor; PARTNO: CL03B103KP3NNNC
C58 C59 C80 C81 = jonnew:C: Capacitor; PARTNO: GRM033R71E103KE14D
C61 C67 C72 C76 C82 C103 = jonnew:C: Capacitor; PARTNO: CL03A105MP3ZSNH
C65 C70 = jonnew:C: Capacitor; PARTNO: UMK105BJ224KV-F
C74 = jonnew:C: Capacitor; PARTNO: CL05A106MQ5NUNC
D1-D3 = jonnew:Z-DIODE: Zener Diode
D4 D5 D9-D11 = jonnew:PHOTODIODE
D6 D7 = jonnew:LED: Surface mount LED
D8 = jonnew:S-DIODE: Schottky Diode
J1 J2 J7 J8 = jonnew:JP2E
J3-J6 J9 J10 = jonnew:COAX: COAX CONNECTOR - Edge mount BNC - Vertical BNC - Vertical SMA - etc
J11 = jonnew:PINHD-2X10+4
J12 = jonnew:PINHD-2X5+4
J13 = jonnew:PINHD-1X2+2
JA JB JC JD = jonnew:PINHD-2X35
L1 L2 L7 L13 L15 L17-L19 = jonnew:L: Inductor; PARTNO: BLM15PX601SN1D
L3-L6 L8-L12 L14 L16 = jonnew:L: Inductor
R1-R98 = jonnew:R: Resistor
U1 U2 = jonnew:QUAD-OPAMP_14PIN: OP AMP
U3 U4 = jonnew:AD5683-VLOGIC
U5 U6 = jonnew:MUX_2X4:1
U7 = jonnew:DS90UB913A
U8 = jonnew:NRF24L01: 2.4GHz Low Power Transceiver This is the very popular, low cost, very low power RF transceiver from Nordic Semiconductor. Simple SPI interface.
U9 U10 = jonnew:CAT4016; PARTNO: CAT4016HV6-GT2
U11 U12 = jonnew:TPL0501; PARTNO: TPL0501-100RSER
U13 = jonnew:MICROSD
U14 = jonnew:10M08SAM153
U15 = jonnew:P-MOSFET
U16 = jonnew:MAX1704X: MAX17043/MAX17044: Battery Fuel Guage (43 is 1cell, 44 is 2cell)
U17 = jonnew:BNO055
U18 = jonnew:CRYSTAL-OSC
U19 = jonnew:TPS61200
U20 U21 U28 U29 = jonnew:RHD2164_BGA: Intan Technologies RHD2164 chip
U22 U23 U25 U27 U31 U32 = jonnew:TS4231
U24 = jonnew:LT3463
U26 = jonnew:TLV707
U30 = jonnew:MIC23150
U33 = jonnew:TPS8268X
Y1 = jonnew:CRYSTAL-GND
Y2 = jonnew:CRYSTAL: Crystals Various standard crystals. Proven footprints. Spark Fun Electronics SKU : COM-00534

## Net classes
1 thick: width 0.102 mm